# Altium project Vayuvedh_UK_Project.PrjPcb
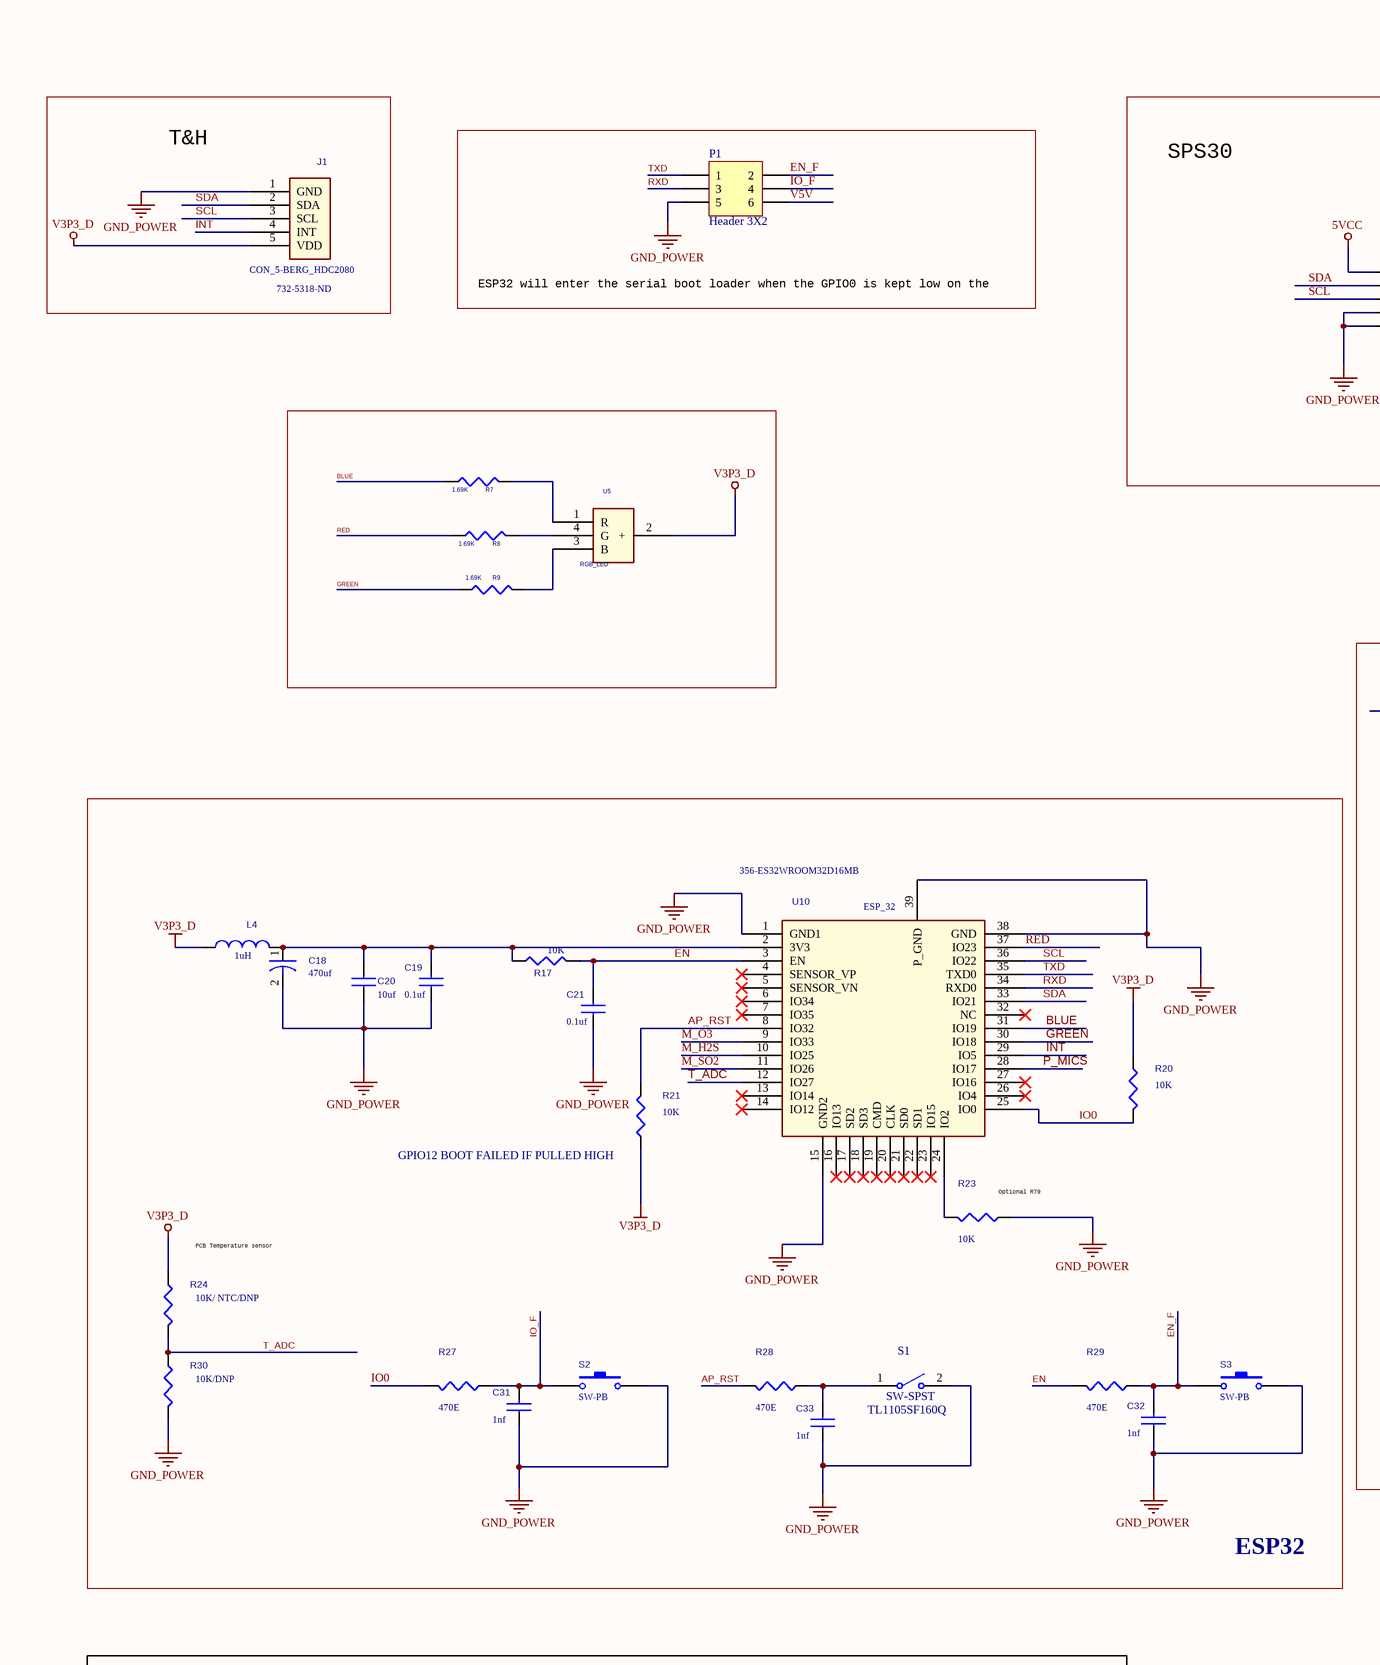
[diagram p0: Vayuvedh U.k.SchDoc, top left]
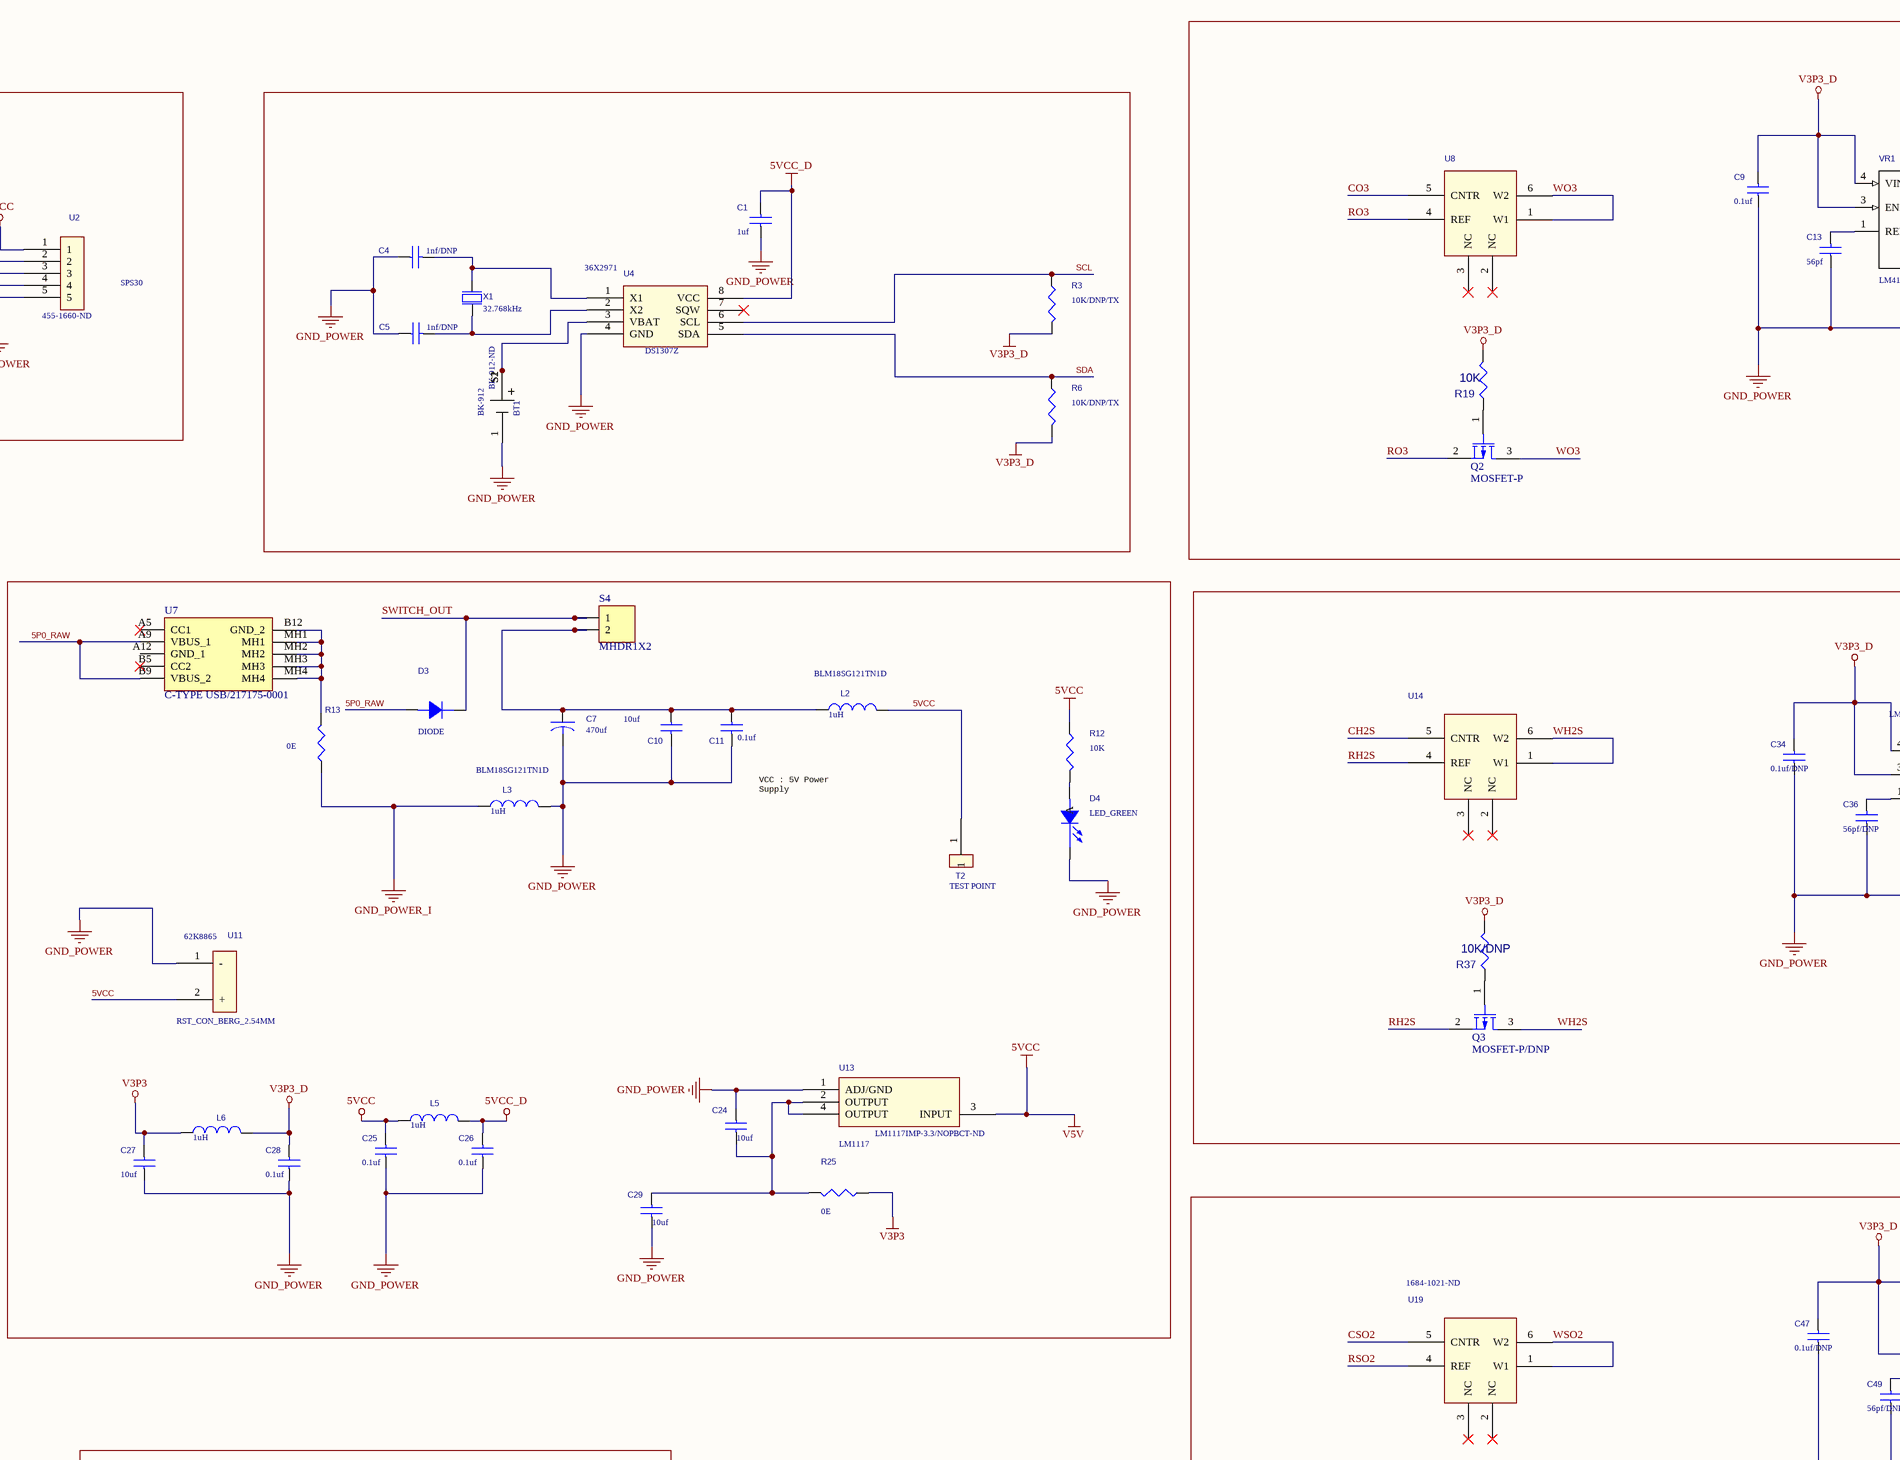
[diagram p1: Vayuvedh U.k.SchDoc, top middle]
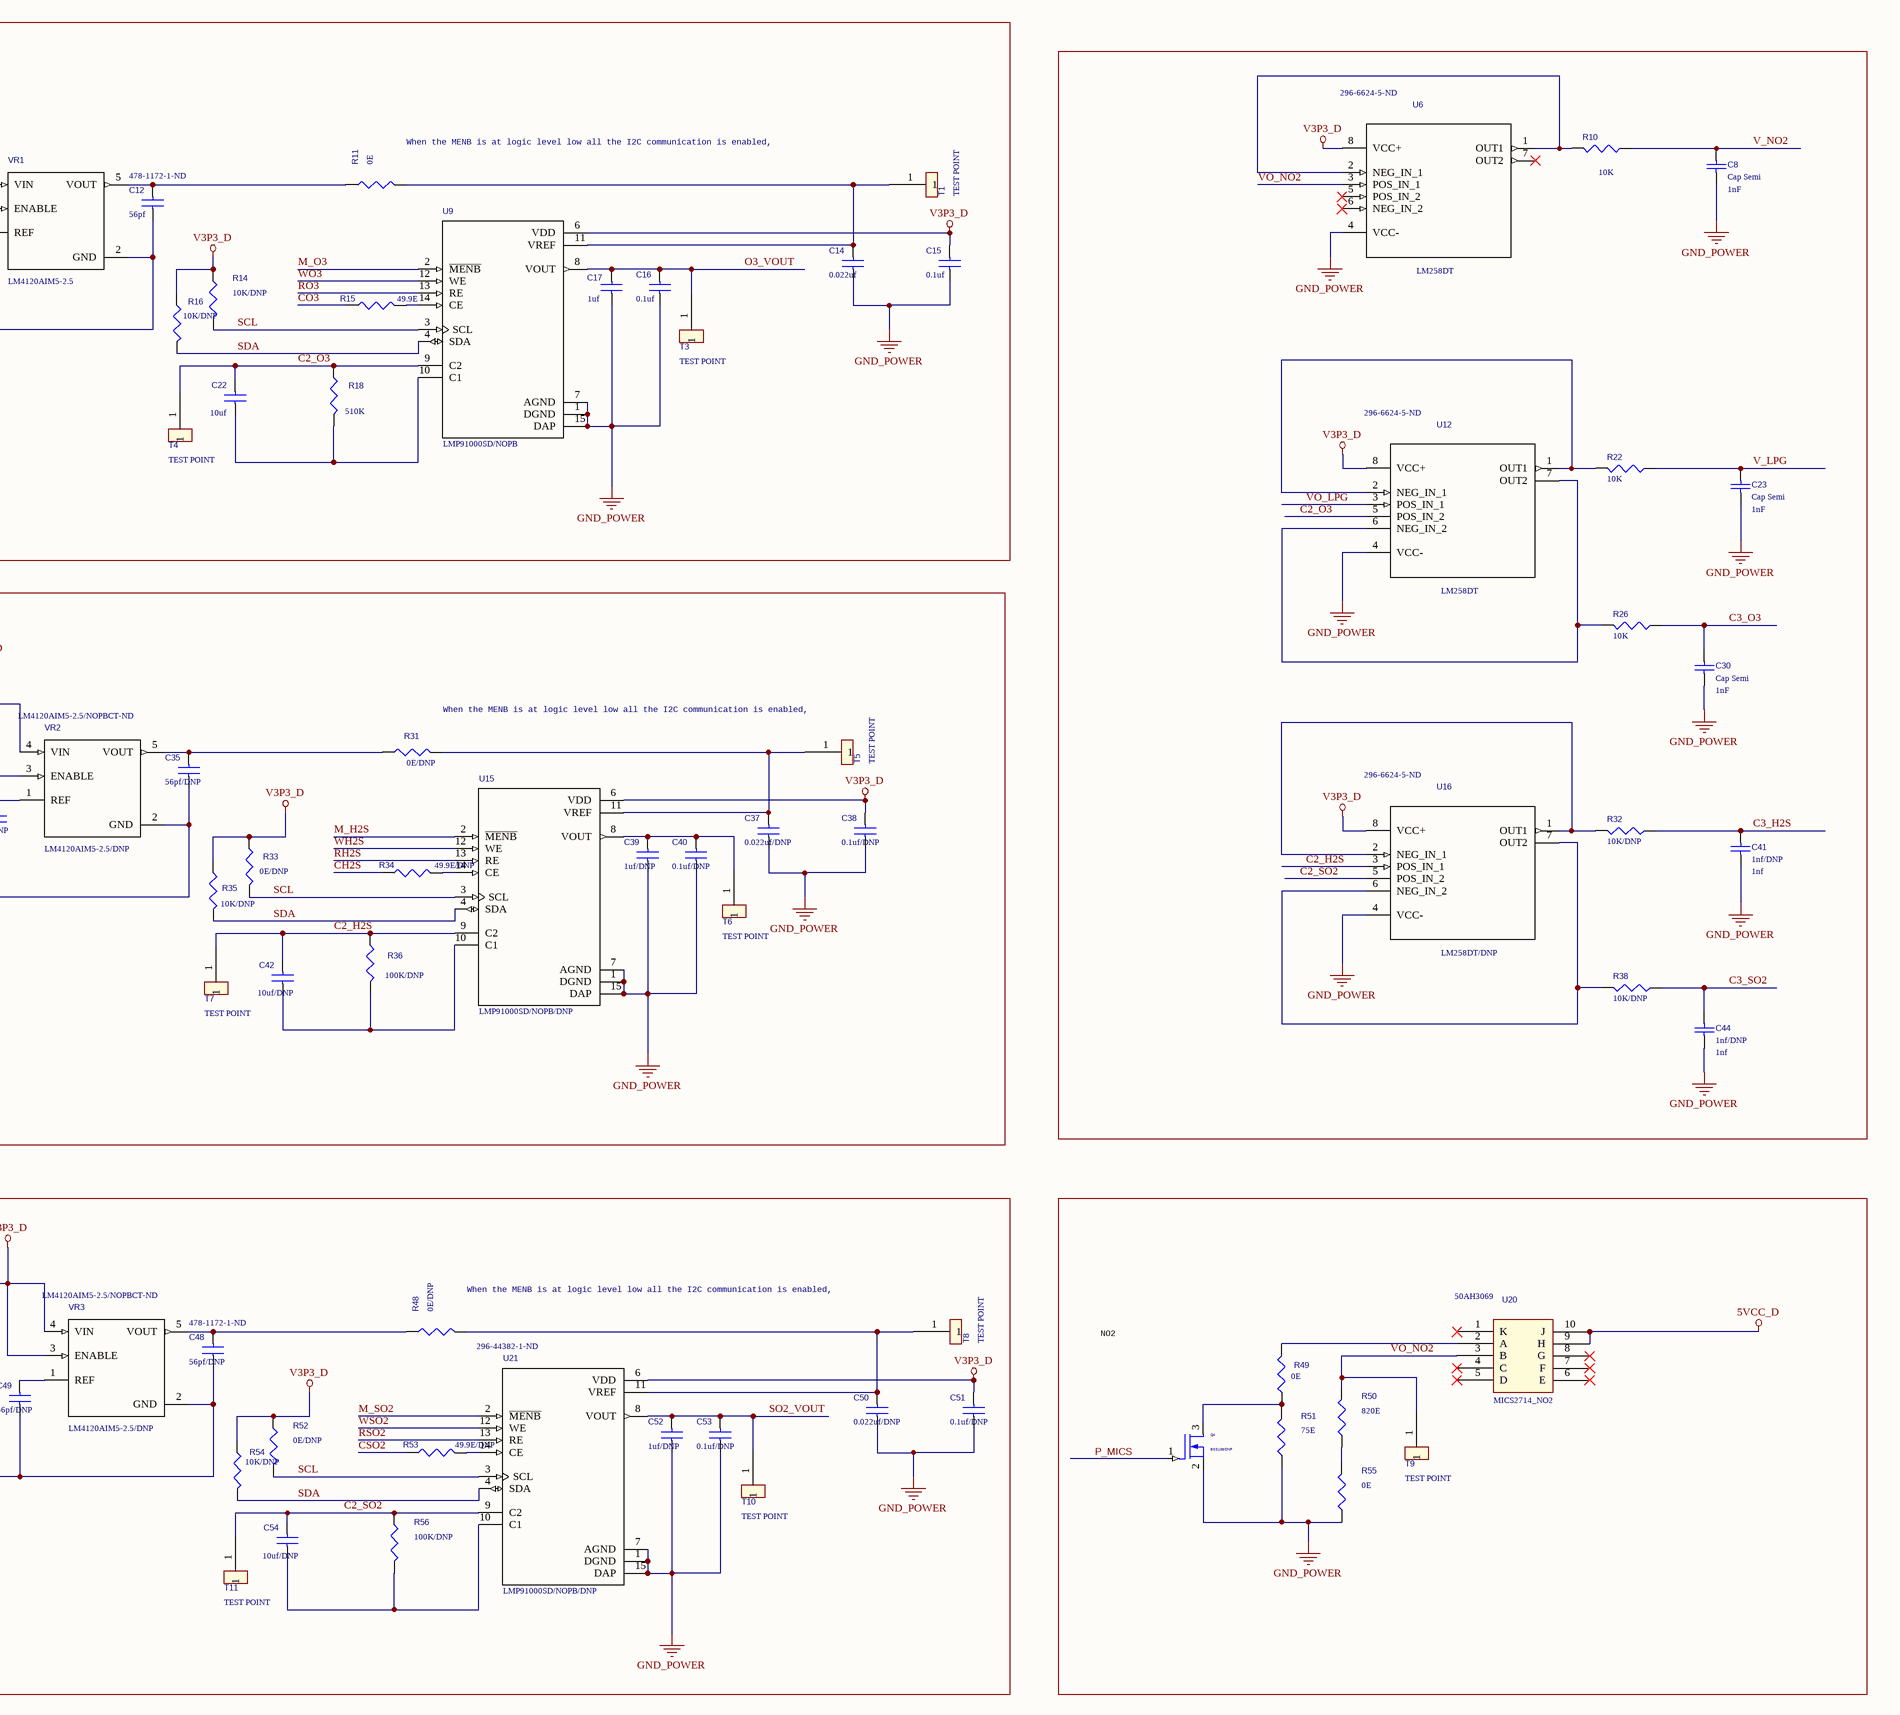
[diagram p2: Vayuvedh U.k.SchDoc, top right]
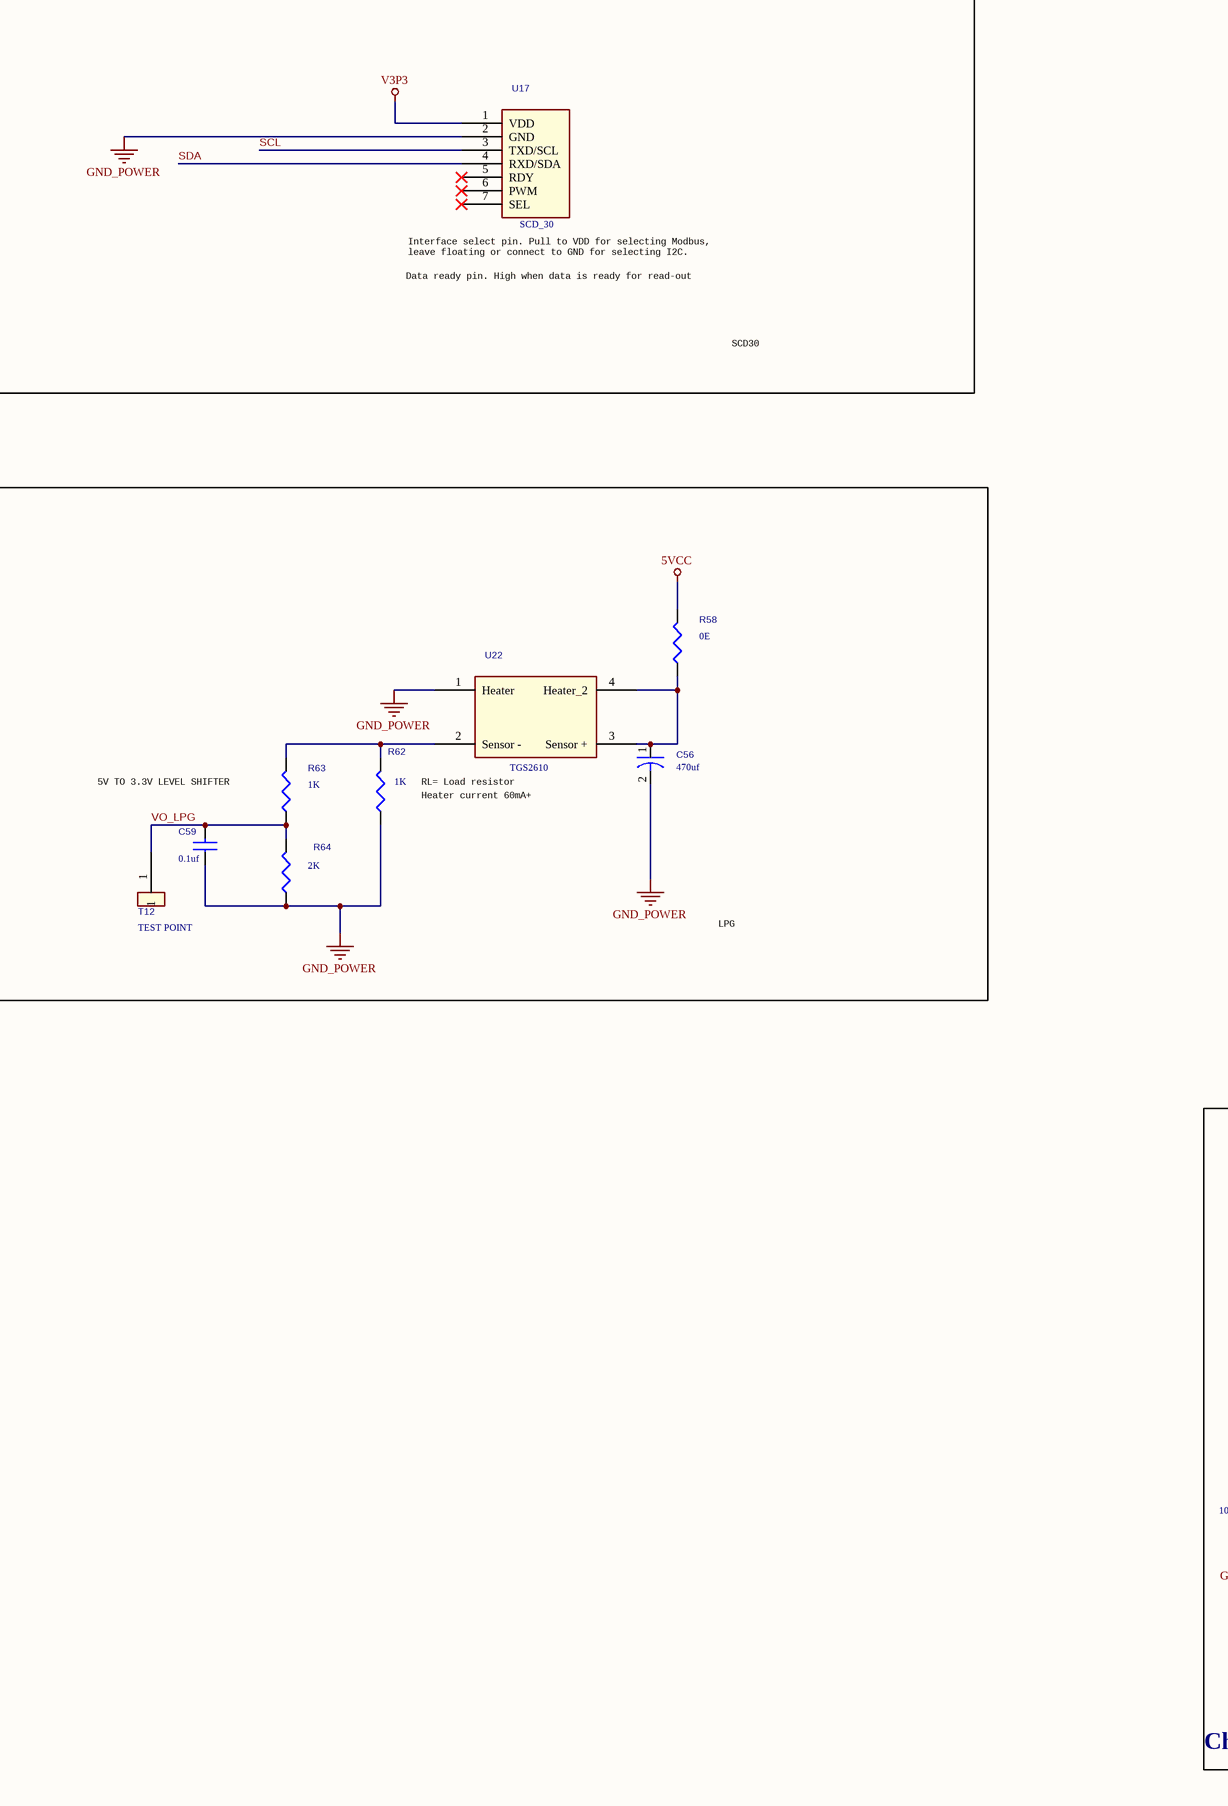
[diagram p3: Vayuvedh U.k.SchDoc, bottom left]
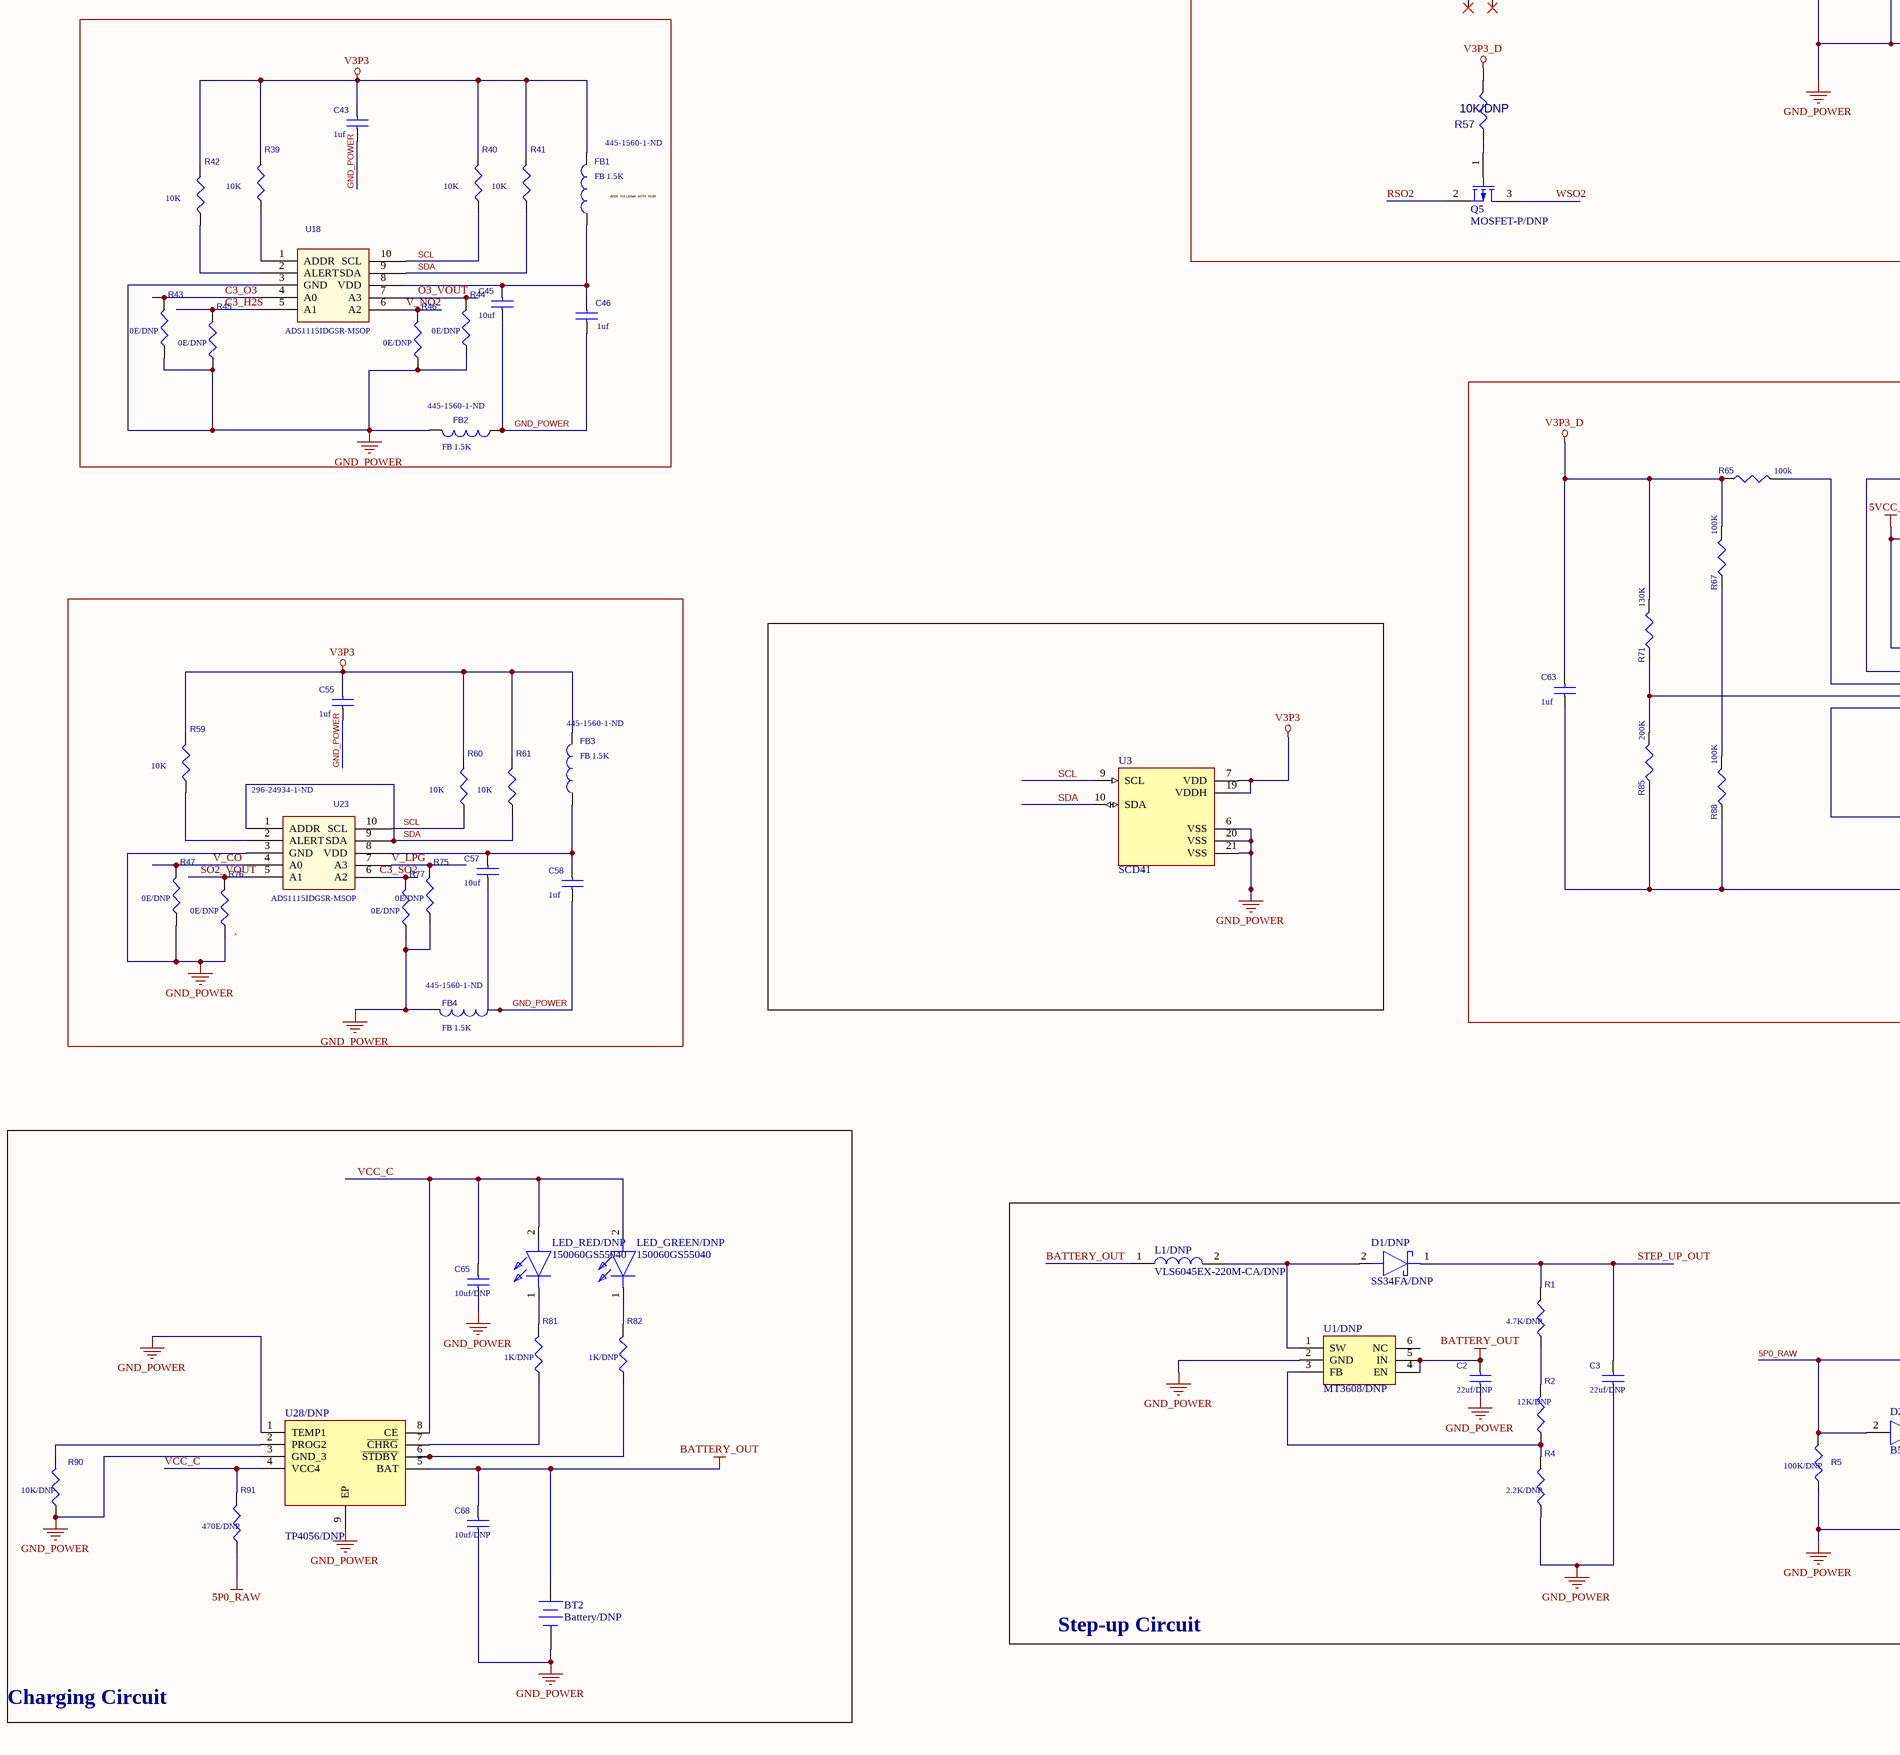
[diagram p4: Vayuvedh U.k.SchDoc, bottom middle]
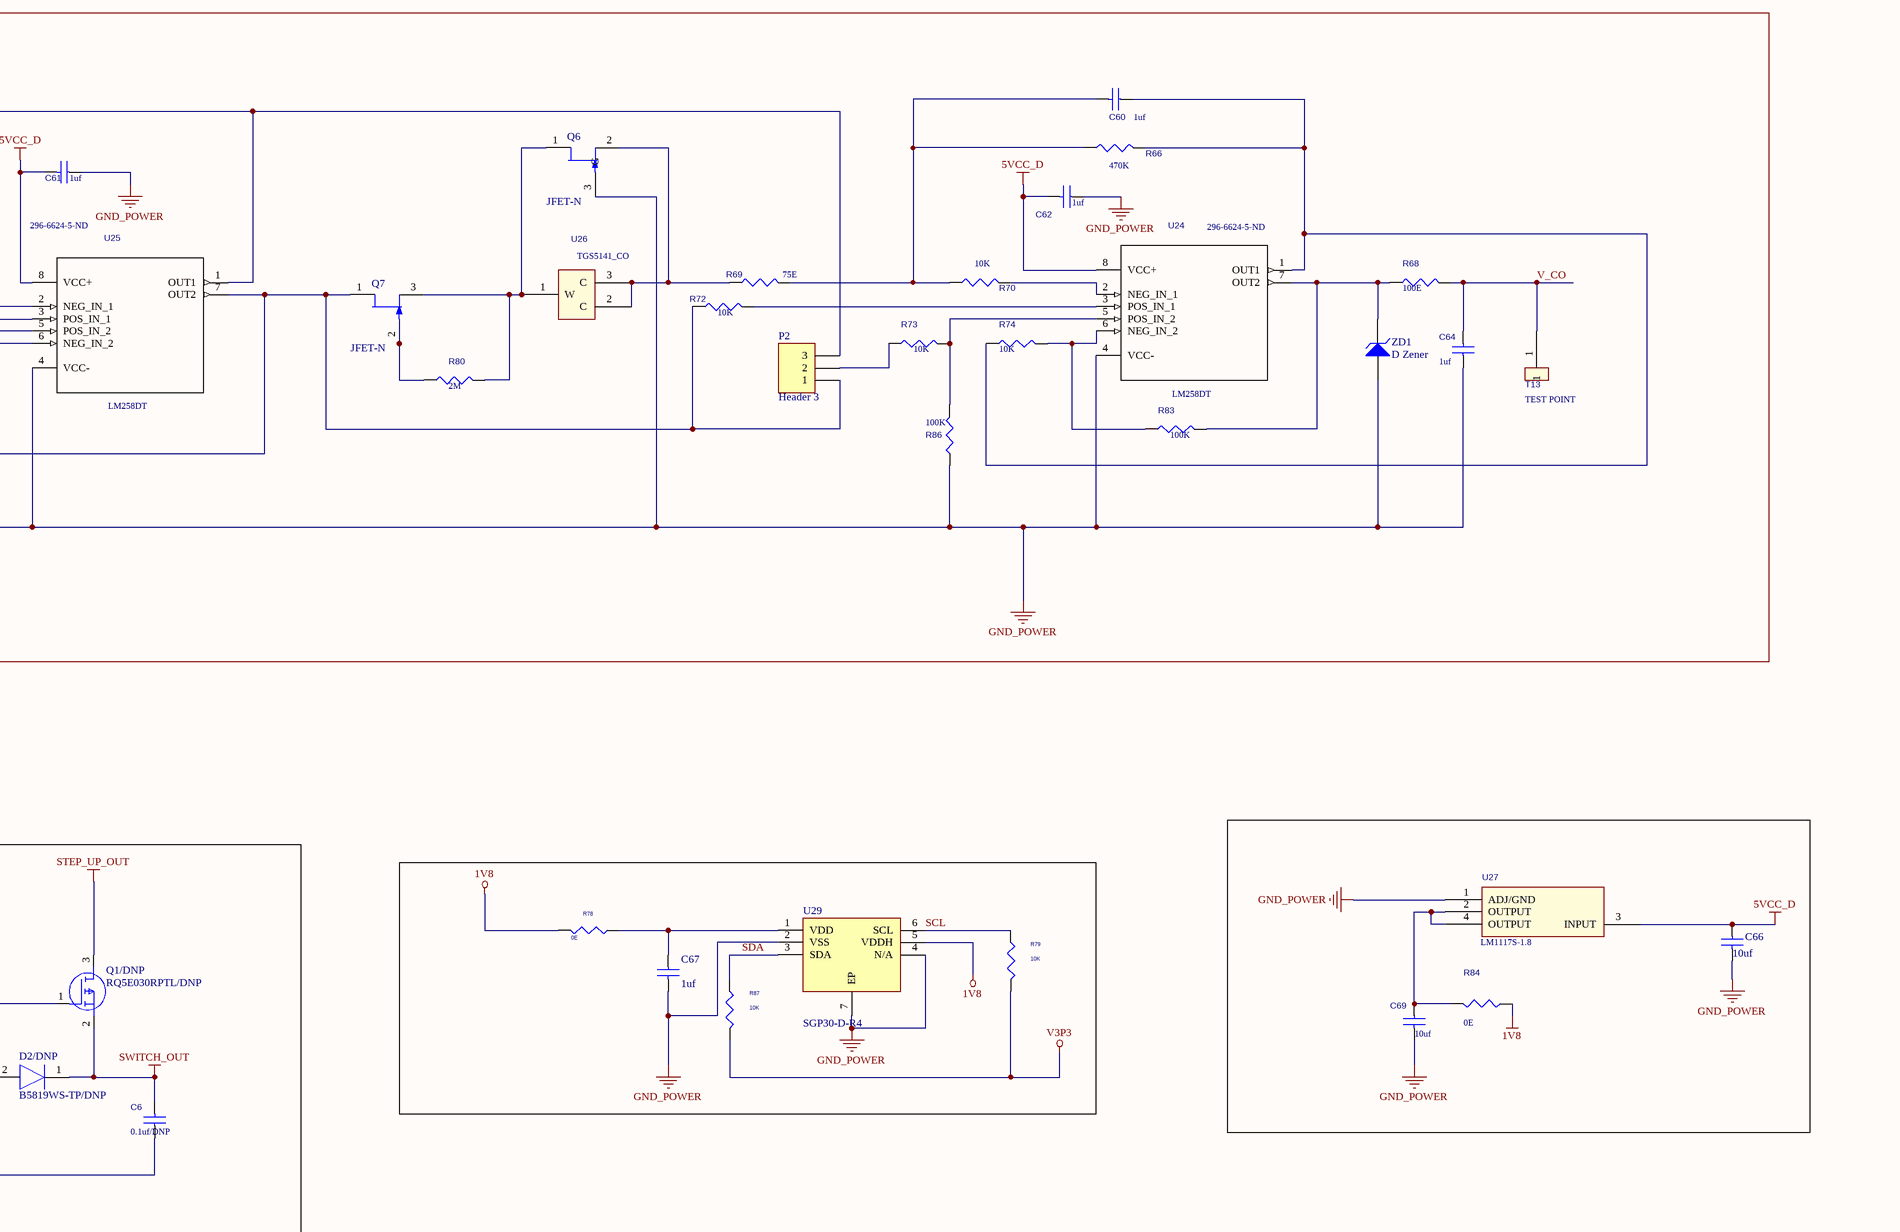
[diagram p5: Vayuvedh U.k.SchDoc, bottom right]
1 sheet, 238 parts. Net scope: global (net labels, ports and power ports of the same name join across sheets).
Board file: Copy of vayuvedh.UK.PcbDoc

## Sheet Vayuvedh U.k.SchDoc
size E

### Parts
BT1  BK-912  Supplier Part Number 1: BK-912-ND  [BT1]
BT2  Battery/DNP  [BAT-2]
C1  1uf  [C0603]
C2  22uf/DNP  [C0603]
C3  22uf/DNP  [C0603]
C4  1nf/DNP  [C0603]
C5  1nf/DNP  [C0603]
C6  0.1uf/DNP  [C0603]
C7  470uf  [C16, C49, C58]
C8  Cap Semi  value 1nF  [C0603]
C9  0.1uf  [C0603]
C10  10uf  [C0603]
C11  0.1uf  [C0603]
C12  56pf  Supplier Part Number 1: 478-1172-1-ND  [C0603]
C13  56pf  [C0603]
C14  0.022uf  [C0603]
C15  0.1uf  [C0603]
C16  0.1uf  [C0603]
C17  1uf  [C0603]
C18  470uf  [C16, C49, C58]
C19  0.1uf  [C0603]
C20  10uf  [C0603]
C21  0.1uf  [C0603]
C22  10uf  [C0603]
C23  Cap Semi  value 1nF  [C0603]
C24  10uf  [C0603]
C25  0.1uf  [C0603]
C26  0.1uf  [C0603]
C27  10uf  [C0603]
C28  0.1uf  [C0603]
C29  10uf  [C0603]
C30  Cap Semi  value 1nF  [C0603]
C31  1nf  [C0603]
C32  1nf  [C0603]
C33  1nf  [C0603]
C34  0.1uf/DNP  [C0603]
C35  56pf/DNP  [C0603]
C36  56pf/DNP  [C0603]
C37  0.022uf/DNP  [C0603]
C38  0.1uf/DNP  [C0603]
C39  1uf/DNP  [C0603]
C40  0.1uf/DNP  [C0603]
C41  1nf/DNP  value 1nf  [C0603]
C42  10uf/DNP  [C0603]
C43  1uf  [C0603]
C44  1nf/DNP  value 1nf  [C0603]
C45  10uf  [C0603]
C46  1uf  [C0603]
C47  0.1uf/DNP  [C0603]
C48  56pf/DNP  Supplier Part Number 1: 478-1172-1-ND  [C0603]
C49  56pf/DNP  [C0603]
C50  0.022uf/DNP  [C0603]
C51  0.1uf/DNP  [C0603]
C52  1uf/DNP  [C0603]
C53  0.1uf/DNP  [C0603]
C54  10uf/DNP  [C0603]
C55  1uf  [C0603]
C56  470uf  [C16, C49, C58]
C57  10uf  [C0603]
C58  1uf  [C0603]
C59  0.1uf  [C0603]
C60  1uf  [C0603]
C61  1uf  [C0603]
C62  1uf  [C0603]
C63  1uf  [C0603]
C64  1uf  [C0603]
C65  10uf/DNP  [C0603]
C66  10uf  [R0603]
C67  1uf  [C0603]
C68  10uf/DNP  [C0603]
C69  10uf  [C0603]
D1/DNP  SS34FA/DNP  [D1]
D2/DNP  B5819WS-TP/DNP  [D1]
D3  DIODE  [D1]
D4  LED_GREEN  [D2              L0603]
FB1  FB 1.5K  Supplier Part Number 1: 445-1560-1-ND  [FB1, FB2, FB3, FB4]
FB2  FB 1.5K  Supplier Part Number 1: 445-1560-1-ND  [FB1, FB2, FB3, FB4]
FB3  FB 1.5K  Supplier Part Number 1: 445-1560-1-ND  [FB1, FB2, FB3, FB4]
FB4  FB 1.5K  Supplier Part Number 1: 445-1560-1-ND  [FB1, FB2, FB3, FB4]
J1  CON_5-BERG_HDC2080  Supplier Part Number 1: 732-5318-ND  [J2]
L1/DNP  VLS6045EX-220M-CA/DNP  [VLS6045]
L2  1uH  Supplier Part Number 1: BLM18SG121TN1D  [L3, L4, L5, L6, L7]
L3  1uH  Supplier Part Number 1: BLM18SG121TN1D  [L3, L4, L5, L6, L7]
L4  1uH  [L3, L4, L5, L6, L7]
L5  1uH  [L3, L4, L5, L6, L7]
L6  1uH  [L3, L4, L5, L6, L7]
LED_GREEN/DNP  150060GS55040  [LEDC1608X50N]
LED_RED/DNP  150060GS55040  [LEDC1608X50N]
P1  Header 3X2  [P5 - new]
P2  Header 3  [P6]
Q1/DNP  RQ5E030RPTL/DNP  [SOT95P280X100-3N]
Q2  MOSFET-P  [Q3-Q5,Q6]
Q3  MOSFET-P/DNP  [Q3-Q5,Q6]
Q4  BSS138/DNP  [Q3-Q5,Q6]
Q5  MOSFET-P/DNP  [Q3-Q5,Q6]
Q6  JFET-N  [SOT23F]
Q7  JFET-N  [Q1-Q2]
R1  4.7K/DNP  [R0603]
R2  12K/DNP  [R0603]
R3  10K/DNP/TX  [R0603]
R4  2.2K/DNP  [R0603]
R5  100K/DNP  [R0603]
R6  10K/DNP/TX  [R0603]
R7  1.69K  [R0603]
R8  1.69K  [R0603]
R9  1.69K  [R0603]
R10  10K  [R0603]
R11  0E  [R0603]
R12  10K  [R0603]
R13  0E  [R0603]
R14  10K/DNP  [R0603]
R15  49.9E  [R0603]
R16  10K/DNP  [R0603]
R17  10K  [R0603]
R18  510K  [R0603]
R19  10K  [R0603]
R20  10K  [R0603]
R21  10K  [R0603]
R22  10K  [R0603]
R23  10K  [R0603]
R24  10K/ NTC/DNP  [R0603]
R25  0E  [R0603]
R26  10K  [R0603]
R27  470E  [R0603]
R28  470E  [R0603]
R29  470E  [R0603]
R30  10K/DNP  [R0603]
R31  0E/DNP  [R0603]
R32  10K/DNP  [R0603]
R33  0E/DNP  [R0603]
R34  49.9E/DNP  [R0603]
R35  10K/DNP  [R0603]
R36  100K/DNP  [R0603]
R37  10K/DNP  [R0603]
R38  10K/DNP  [R0603]
R39  10K  [R0603]
R40  10K  [R0603]
R41  10K  [R0603]
R42  10K  [R0603]
R43  0E/DNP  [R0603]
R44  0E/DNP  [R0603]
R45  0E/DNP  [R0603]
R46  0E/DNP  [R0603]
R47  0E/DNP  [R0603]
R48  0E/DNP  [R0603]
R49  0E  [R0603]
R50  820E  [R0603]
R51  75E  [R0603]
R52  0E/DNP  [R0603]
R53  49.9E/DNP  [R0603]
R54  10K/DNP  [R0603]
R55  0E  [R0603]
R56  100K/DNP  [R0603]
R57  10K/DNP  [R0603]
R58  0E  [R0603]
R59  10K  [R0603]
R60  10K  [R0603]
R61  10K  [R0603]
R62  1K  [R0603]
R63  1K  [R0603]
R64  2K  [R0603]
R65  100k  [R0603]
R66  470K  [R0603]
R67  100K  [R0603]
R68  100E  [R0603]
R69  75E  [R0603]
R70  10K  [R0603]
R71  130K  [R0603]
R72  10K  [R0603]
R73  10K  [R0603]
R74  10K  [R0603]
R75  0E/DNP  [R0603]
R76  0E/DNP  [R0603]
R77  0E/DNP  [R0603]
R78  0E  [R0603]
R79  10K  [R0603]
R80  2M  [R0603]
R81  1K/DNP  [R0603]
R82  1K/DNP  [R0603]
R83  100K  [R0603]
R84  0E  [R0603]
R85  200K  [R0603]
R86  100K  [R0603]
R87  10K  [R0603]
R88  100K  [R0603]
R90  10K/DNP  [R0603]
R91  470E/DNP  [R0603]
S1  SW-SPST  Part Number: TL1105SF160Q  [S1]
S2  SW-PB  [S2, S3]
S3  SW-PB  [S2, S3]
S4  MHDR1X2  [MHDR1X2]
T1  TEST POINT  [TP]
T2  TEST POINT  [TP]
T3  TEST POINT  [TP]
T4  TEST POINT  [TP]
T5  TEST POINT  [TP]
T6  TEST POINT  [TP]
T7  TEST POINT  [TP]
T8  TEST POINT  [TP]
T9  TEST POINT  [TP]
T10  TEST POINT  [TP]
T11  TEST POINT  [TP]
T12  TEST POINT  [TP]
T13  TEST POINT  [TP]
U1/DNP  MT3608/DNP  [SOT95P280X145-6N]
U2  SPS30  Supplier Part Number 1: 455-1660-ND  [U17]
U3  SCD41  [SCD4x]
U4  DS1307Z  Supplier Part Number 1: 36X2971  [U18 new]
U5  RGB_LED  [WL-SFCW_1206]
U6  LM258DT  Supplier Part Number 1: 296-6624-5-ND  [U6, U8                    SOIC-8N]
U7  C-TYPE USB/217175-0001  [MOLEX_2171750001]
U8  SPEC_SENS_PTH_SO2  [U3, U7, U11]  (value not drawn)
U9  LMP91000SD/NOPB  [U5, U10, U13]
U10  ESP_32  Supplier Part Number 1: 356-ES32WROOM32D16MB  [U20             ESP 32]
U11  RST_CON_BERG_2.54MM  Supplier Part Number 1: 62K8865  [U23]
U12  LM258DT  Supplier Part Number 1: 296-6624-5-ND  [U6, U8                    SOIC-8N]
U13  LM1117  Supplier Part Number 1: LM1117IMP-3.3/NOPBCT-ND  [U1, U24              SOT-223]
U14  SPEC_SENS_PTH_SO2  [U3, U7, U11]  (value not drawn)
U15  LMP91000SD/NOPB/DNP  [U5, U10, U13]
U16  LM258DT/DNP  Supplier Part Number 1: 296-6624-5-ND  [U6, U8                    SOIC-8N]
U17  SCD_30  [U3]
U18  ADS1115IDGSR-MSOP  [U19, U20]
U19  Supplier Part Number 1: 1684-1021-ND  [U3, U7, U11]  (hidden comment: SPEC_SENS_PTH_SO2)
U20  MICS2714_NO2  Supplier Part Number 1: 50AH3069  [U12]
U21  LMP91000SD/NOPB/DNP  Supplier Part Number 1: 296-44382-1-ND  [U5, U10, U13]
U22  TGS2610  [U4]
U23  ADS1115IDGSR-MSOP  Supplier Part Number 1: 296-24934-1-ND  [U19, U20]
U24  LM258DT  Supplier Part Number 1: 296-6624-5-ND  [U6, U8                    SOIC-8N]
U25  LM258DT  Supplier Part Number 1: 296-6624-5-ND  [U28]
U26  TGS5141_CO  [U16]
U27  LM1117S-1.8  [U1, U24              SOT-223]
U28/DNP  TP4056/DNP  [SOIC127P600X175-9N]
U29  SGP30-D-R4  [SGP30]
VR1  LM4120AIM5-2.5  [VR1, VR2, VR3]
VR2  LM4120AIM5-2.5/DNP  Supplier Part Number 1: LM4120AIM5-2.5/NOPBCT-ND  [VR1, VR2, VR3]
VR3  LM4120AIM5-2.5/DNP  Supplier Part Number 1: LM4120AIM5-2.5/NOPBCT-ND  [VR1, VR2, VR3]
X1  32.768kHz  [XTAL]
ZD1  D Zener  [ZD1]

### Blocks framed on the sheet
T&H: J1
SPS30: U2
ESP32: C18-C21 C31-C33 L4 R17 R20 R21 R23 R24 R27-R30 S1-S3 U10
NO2: Q4 R49-R51 R55 T9 U20
ADDR PULLDOWN WITH 0X48: C43 C45 C46 FB1 FB2 R39-R46 U18
A: C55 C57 C58 FB3 FB4 R47 R59-R61 R75-R77 U23
Charging Circuit: BT2 C65 C68 LED_GREEN/DNP LED_RED/DNP R81 R82 R90 R91 U28/DNP
Step-up Circuit: C2 C3 C6 D1/DNP D2/DNP L1/DNP Q1/DNP R1 R2 R4 R5 U1/DNP

### Nets
1V8: R78.2 R84.1 U29.5(VDDH)
5P0_RAW: D2/DNP.2(A) D3.2(A) Q1/DNP.1(G) R5.1 R91.2 U7.A9(VBUS_1) U7.B9(VBUS_2)
5VCC: C25.2 L2.2 L5.1 P1.6 R12.1 R58.2 T2.1 U2.1 U11.2(+) U13.3(INPUT)  [also labelled V5V]
5VCC_D: C1.2 C26.2 C61.2 C62.2 C66.1 L5.2 U4.8(VCC) U20.9(H) U20.10(J) U24.8(VCC+) U25.8(VCC+) U27.3(INPUT)
BATTERY_OUT: BT2.1(+) C2.2 C68.2 L1/DNP.1 U1/DNP.4(EN) U1/DNP.5(IN) U28/DNP.5(BAT)
GND_POWER: BT1.1(NEG) BT2.2(-) C1.1 C2.1 C3.1 C4.1 C5.1 C6.1 C7.2 C8.1 C9.1 C10.2 C11.2 C12.1 C13.1 C14.1 C15.1 C16.1 C17.1 C18.2 C19.1 C20.1 C21.1 C23.1 C24.1 C25.1 C26.1 C27.1 C28.1 C29.2 C30.1 C31.1 C32.1 C33.1 C34.1 C35.1 C36.1 C37.1 C38.1 C39.1 C40.1 C41.1 C43.1 C44.1 C45.1 C46.1 C47.1 C48.1 C49.1 C50.1 C51.1 C52.1 C53.1 C55.1 C56.2 C57.1 C58.1 C59.1 C61.1 C62.1 C63.1 C64.1 C65.1 C66.2 C67.2 C68.1 C69.2 D4.2(CATHODE) FB2.1 FB2.2 FB4.1 FB4.2 J1.1(GND) L3.2 P1.5 Q4.2(SOURCE) Q6.3(G) R4.2 R5.2 R23.1 R30.2 R43.2 R44.2 R45.2 R46.2 R47.2 R51.1 R55.1 R62.2 R64.1 R75.2 R76.2 R77.2 R85.1 R86.1 R88.1 R90.2 S1.2(NO) S2.2 S3.2 U1/DNP.2(GND) U2.4 U2.5 U3.6(VSS) U3.20(VSS) U3.21(VSS) U4.4(GND) U6.4(VCC-) U9.1(DGND) U9.7(AGND) U9.15(DAP) U10.1(GND1) U10.15(GND2) U10.38(GND) U10.39(P_GND) U11.1(-) U12.4(VCC-) U13.1(ADJ/GND) U15.1(DGND) U15.7(AGND) U15.15(DAP) U16.4(VCC-) U17.2(GND) U18.3(GND) U21.1(DGND) U21.7(AGND) U21.15(DAP) U22.1(Heater) U23.3(GND) U24.4(VCC-) U25.4(VCC-) U27.1(ADJ/GND) U28/DNP.1(TEMP1) U28/DNP.3(GND_3) U28/DNP.9(EP) U29.2(VSS) U29.4(N/A) U29.7(EP) VR1.2(GND) VR2.2(GND) VR3.2(GND) ZD1.1(A)
GND_POWER_I: L3.1 R13.2
STEP_UP_OUT: C3.2 D1/DNP.1(K) Q1/DNP.3(D) R1.1
SWITCH_OUT: C6.2 D2/DNP.1(K) D3.1(K) Q1/DNP.2(S) S4.1
V3P3: C27.2 C43.2 C55.2 FB1.2 FB3.2 L6.1 R25.1 R39.1 R40.1 R41.1 R42.1 R59.1 R60.1 R61.1 R79.2 R87.2 U3.7(VDD) U3.19(VDDH) U17.1(VDD)
V3P3_D: C9.2 C15.2 C28.2 C34.2 C38.2 C47.2 C51.2 C63.2 J1.5(VDD) L4.1 L6.2 R3.2 R6.2 R14.1 R16.1 R19.2 R20.1 R21.1 R24.1 R33.1 R35.1 R37.2 R52.1 R54.1 R57.2 R65.1 R67.2 R71.2 U5.2(+) U6.8(VCC+) U9.6(VDD) U12.8(VCC+) U15.6(VDD) U16.8(VCC+) U21.6(VDD) VR1.3(ENABLE) VR1.4(VIN) VR2.3(ENABLE) VR2.4(VIN) VR3.3(ENABLE) VR3.4(VIN)
AP_RST: R21.2 R28.2 U10.8(IO32)
BLUE: R7.1 U10.31(IO19)
C2_H2S: C42.2 R36.1 T7.1 U15.9(C2) U16.3(POS_IN_1)
C2_O3: C22.2 R18.1 T4.1 U9.9(C2) U12.5(POS_IN_2)
C2_SO2: C54.2 R56.1 T11.1 U16.5(POS_IN_2) U21.9(C2)
C3_H2S: C41.2 R32.1 R45.1 U18.5(A1)
C3_O3: C30.2 R26.1 R43.1 U18.4(A0)
C3_SO2: C44.2 R38.1
CH2S: R34.1 U14.5(CNTR)
CO3: R15.1 U8.5(CNTR)
CSO2: R53.1 U19.5(CNTR)
EN: C21.2 R17.2 R29.2 U10.3(EN)
EN_F: C32.2 P1.2 R29.1 S3.1
GREEN: R9.1 U10.30(IO18)
INT: J1.4(INT) U10.29(IO5)
IO0: R20.2 R27.2 U10.25(IO0)
IO_F: C31.2 P1.4 R27.1 S2.1
M_H2S: U10.10(IO25) U15.2(~{MENB})
M_O3: U9.2(~{MENB}) U10.9(IO33)
M_SO2: U10.11(IO26) U21.2(~{MENB})
O3_VOUT: C16.2 C17.2 R44.1 T3.1 U9.8(VOUT) U18.7(A3)
P_MICS: Q4.1(GATE) U10.28(IO17)
RED: R8.1 U10.37(IO23)
RH2S: Q3.2(S) U14.4(REF) U15.13(RE)
RO3: Q2.2(S) U8.4(REF) U9.13(RE)
RSO2: Q5.2(S) U19.4(REF) U21.13(RE)
RXD: P1.3 U10.34(RXD0)
SCL: J1.3(SCL) R3.1 R14.2 R33.2 R40.2 R52.2 R60.2 R79.1 U2.3 U3.9(SCL) U4.6(SCL) U9.3(SCL) U10.36(IO22) U15.3(SCL) U17.3(TXD/SCL) U18.10(SCL) U21.3(SCL) U23.10(SCL) U29.6(SCL)
SDA: J1.2(SDA) R6.1 R16.2 R35.2 R41.2 R54.2 R61.2 R87.1 U2.2 U3.10(SDA) U4.5(SDA) U9.4(SDA) U10.33(IO21) U15.4(SDA) U17.4(RXD/SDA) U18.9(SDA) U21.4(SDA) U23.1(ADDR) U23.9(SDA) U29.3(SDA)
SO2_VOUT: C52.2 C53.2 R76.1 T10.1 U21.8(VOUT) U23.5(A1)
T_ADC: R24.2 R30.1 U10.12(IO27)
TXD: P1.1 U10.35(TXD0)
V_CO: C64.2 R47.1 R68.2 T13.1 U23.4(A0)
V_LPG: C23.2 R22.1 R75.1 U23.7(A3)
V_NO2: C8.2 R10.1 R46.1 U18.6(A2)
VCC_C: C65.2 LED_GREEN/DNP.2(A) LED_RED/DNP.2(A) R91.1 U28/DNP.4(VCC4) U28/DNP.8(CE)
VO_LPG: C59.2 R63.1 R64.2 T12.1 U12.3(POS_IN_1)
VO_NO2: R50.2 T9.1 U6.3(POS_IN_1) U20.3(B)
WH2S: Q3.3(D) U14.1(W1) U14.6(W2) U15.12(WE)
WO3: Q2.3(D) U8.1(W1) U8.6(W2) U9.12(WE)
WSO2: Q5.3(D) U19.1(W1) U19.6(W2) U21.12(WE)
NetBT1_S1: BT1.S1(POS) BT1.S2(POS) U4.3(VBAT)
NetC4_2: C4.2 U4.1(X1) X1.1(inp)
NetC5_2: C5.2 U4.2(X2) X1.2(out)
NetC7_1: C7.1 C10.1 C11.1 L2.1 S4.2
NetC12_2: C12.2 R11.1 VR1.5(VOUT)
NetC13_2: C13.2 VR1.1(REF)
NetC14_2: C14.2 R11.2 T1.1 U9.11(VREF)
NetC18_1: C18.1 C19.2 C20.2 L4.2 R17.1 U10.2(3V3)
NetC22_1: C22.1 R18.2 U9.10(C1)
NetC24_2: C24.2 C29.1 R25.2 U13.2(OUTPUT) U13.4(OUTPUT)
NetC33_2: C33.2 R28.1 S1.1(COMMON)
NetC35_2: C35.2 R31.1 VR2.5(VOUT)
NetC36_2: C36.2 VR2.1(REF)
NetC37_2: C37.2 R31.2 T5.1 U15.11(VREF)
NetC39_2: C39.2 C40.2 T6.1 U15.8(VOUT)
NetC42_1: C42.1 R36.2 U15.10(C1)
NetC45_2: C45.2 C46.2 FB1.1 U18.8(VDD)
NetC48_2: C48.2 R48.1 VR3.5(VOUT)
NetC49_2: C49.2 VR3.1(REF)
NetC50_2: C50.2 R48.2 T8.1 U21.11(VREF)
NetC54_1: C54.1 R56.2 U21.10(C1)
NetC56_1: C56.1 R58.1 U22.3(Sensor_+) U22.4(Heater_2)
NetC57_2: C57.2 C58.2 FB3.1 U23.8(VDD)
NetC60_1: C60.1 R66.2 R74.1 U24.1(OUT1)
NetC60_2: C60.2 R66.1 R69.2 R70.1
NetC67_1: C67.1 R78.1 U29.1(VDD)
NetC69_1: C69.1 R84.2 U27.2(OUTPUT) U27.4(OUTPUT)
NetD1/DNP_2: D1/DNP.2(A) L1/DNP.2 U1/DNP.1(SW)
NetD4_1: D4.1(A) R12.2
NetLED_GREEN/DNP_1: LED_GREEN/DNP.1(K) R82.1
NetLED_RED/DNP_1: LED_RED/DNP.1(K) R81.1
NetP2_1: P2.1 Q7.1(D) R72.1 U25.6(NEG_IN_2) U25.7(OUT2)
NetP2_2: P2.2 R73.1
NetP2_3: P2.3 U25.1(OUT1) U25.2(NEG_IN_1)
NetQ2_1: Q2.1(G) R19.1
NetQ3_1: Q3.1(G) R37.1
NetQ4_3: Q4.3(DRAIN) R49.1 R51.2
NetQ5_1: Q5.1(G) R57.1
NetQ6_1: Q6.1(D) Q7.3(S) R80.2 U26.1(W)
NetQ6_2: Q6.2(S) R69.1 U26.2(C) U26.3(C)
NetQ7_2: Q7.2(G) R80.1
NetR1_2: R1.2 R2.1
NetR2_2: R2.2 R4.1 U1/DNP.3(FB)
NetR7_2: R7.2 U5.1(R)
NetR8_2: R8.2 U5.4(G)
NetR9_2: R9.2 U5.3(B)
NetR10_2: R10.2 U6.1(OUT1) U6.2(NEG_IN_1)
NetR13_1: R13.1 U7.B12(GND_2) U7.MH1 U7.MH2 U7.MH3 U7.MH4
NetR15_2: R15.2 U9.14(CE)
NetR22_2: R22.2 U12.1(OUT1) U12.2(NEG_IN_1)
NetR23_2: R23.2 U10.24(IO2)
NetR26_2: R26.2 U12.6(NEG_IN_2) U12.7(OUT2)
NetR32_2: R32.2 U16.1(OUT1) U16.2(NEG_IN_1)
NetR34_2: R34.2 U15.14(CE)
NetR38_2: R38.2 U16.6(NEG_IN_2) U16.7(OUT2)
NetR39_2: R39.2 U18.1(ADDR)
NetR42_2: R42.2 U18.2(ALERT)
NetR49_2: R49.2 U20.2(A)
NetR50_1: R50.1 R55.2
NetR53_2: R53.2 U21.14(CE)
NetR59_2: R59.2 U23.2(ALERT)
NetR62_1: R62.1 R63.2 U22.2(Sensor_-)
NetR65_2: R65.2 U25.3(POS_IN_1)
NetR67_1: R67.1 R88.2
NetR68_1: R68.1 R83.2 U24.7(OUT2) ZD1.2(K)
NetR70_2: R70.2 U24.2(NEG_IN_1)
NetR71_1: R71.1 R85.2 U25.5(POS_IN_2)
NetR72_2: R72.2 U24.3(POS_IN_1)
NetR73_2: R73.2 R86.2 U24.5(POS_IN_2)
NetR74_2: R74.2 R83.1 U24.6(NEG_IN_2)
NetR77_1: R77.1 U23.6(A2)
NetR81_2: R81.2 U28/DNP.7(~{CHRG})
NetR82_2: R82.2 U28/DNP.6(~{STDBY})
NetR90_1: R90.1 U28/DNP.2(PROG2)

Not connected (* = marked no-connect by the designer): U1/DNP 6(NC); U4 7(SQW)*; U6 5(POS_IN_2)* 6(NEG_IN_2)* 7(OUT2)*; U7 A5(CC1)* A12(GND_1) B5(CC2)*; U8 2(NC)* 3(NC)*; U10 4(SENSOR_VP)* 5(SENSOR_VN)* 6(IO34)* 7(IO35)* 13(IO14)* 14(IO12)* 16(IO13)* 17(SD2)* 18(SD3)* 19(CMD)* 20(CLK)* 21(SD0)* 22(SD1)* 23(IO15)* 26(IO4)* 27(IO16)* 32(NC)*; U14 2(NC)* 3(NC)*; U17 5(RDY)* 6(PWM)* 7(SEL)*; U19 2(NC)* 3(NC)*; U20 1(K)* 4(C)* 5(D)* 6(E)* 7(F)* 8(G)*

### Notes on the sheet
- (near R11) When the MENB is at logic level low all the I2C communication is enabled,
- ESP32 will enter the serial boot loader when the GPIO0 is kept low on the reset.
  Otherwise, it will run the program in flash.
- (near R31) When the MENB is at logic level low all the I2C communication is enabled,
- VCC : 5V Power Supply
  D-  : USB D- Signal
  D+ : USB D+ Signal
  ID  : USB Identifier Signal for OTG Devices
  GND : Power Ground
- (near R21) GPIO12 BOOT FAILED IF PULLED HIGH
- (near R24) PCB Temperature sensor
- (near R23) Optional R79
- (near R48) When the MENB is at logic level low all the I2C communication is enabled,
- Data ready pin. High when data is ready for read-out
- (near U17) Interface select pin. Pull to VDD for selecting Modbus,
  leave floating or connect to GND for selecting I2C.
- SCD30
- 5V TO 3.3V LEVEL SHIFTER
- RL= Load resistor
- Heater current 60mA+
- LPG
- Labels drawn without touching a wire or pin: C3_SO2
- Title
- Size:
- Date:
- File:
- E
- Number:
- Time:
- Revision:
- Sheet
- of

### Library data of the parts
BT1 = BK-912: BATTERY RETAINER COIN 20MM SMD; MF: MPD; Price: None; Package: None; MP: BK-912; Availability: Unavailable; SnapEDA_Link: https://www.snapeda.com/parts/BK-912/Memory%20Protection%20Devices/view-part/4219672/?ref=snap; Value: *; Supplier 1: Digi-Key
BT2 = Battery: Multicell Battery; Published: 24-Mar-1999; LatestRevisionDate: 17-Jul-2002; LatestRevisionNote: Re-released for DXP Platform.; PackageReference: BAT-2; Publisher: Altium Limited; PackageDescription: Battery; 2 Leads
C1-C3 C6 C43 C45 C46 C55 C57-C65 C68 = CAP_C_0.1µF/16V: CAP CER SMD 0.1µF/16V; Manufacturer: Murata Electronics North America; Manufacturer Part Number: GRM155R61H104KE19D; Capacitance: 1nF; Tolerance: ±10%; Voltage - Rated: 16V; Temperature Coefficient: X5R; Supplier 1: Digi-Key; Supplier Part Number 1: 490-11917-1-ND; RoHS: RoHS Compliant; Category: Capacitors; Stock 1: 958509; Pricing 1: 1=0.1, 10=0.062, 25=0.0456, 50=0.034, 100=0.0278, 250=0.02328, 500=0.01988, 1000=0.01562, 5000=0.01307 (USD); Packaging: Cut Tape (CT); Part Status: Active; Operating Temperature: -55°C ~ 85°C; Features: -; Ratings: -; Applications: General Purpose; Mounting Type: Surface Mount, MLCC; Size / Dimension: 0.039" L x 0.020" W (1.00mm x 0.50mm); Height - Seated (Max): -; Thickness (Max): 0.022" (0.55mm); Lead Spacing: -; Lead Style: -; ComponentLink1URL: http://www.murata.com/~/media/webrenewal/support/library/catalog/products/capacitor/mlcc/c02e.ashx; ComponentLink1Description: http://www.murata.com/~/media/webrenewal/support/library/catalog/products/capacitor/mlcc/c02e.ashx
C4 C5 C10 C11 = CAP NP: CAP CER 22UF 10V X5R 0603; Part Number: GRM188R61A226ME15D
C7 C18 C56 = CAP: CAP ALUM 470UF 20% 50V RADIAL; Part Number: 871-B41896E6477M000
C8 C23 C30 C41 C44 = Cap Semi: Capacitor (Semiconductor SIM Model); Published: 8-Jun-2000; LatestRevisionDate: 29-May-2009; LatestRevisionNote: IPC-7351 Footprint Added.; PackageReference: C1206; Publisher: Altium Limited; PackageDescription: Chip Capacitor
C9 C14-C17 C21 C25-C28 C34 C37-C40 C47 C50-C53 = CAP_C_0.1µF/16V: CAP CER SMD 0.1µF/16V; Manufacturer: Murata Electronics North America; Manufacturer Part Number: GRM155R61H104KE19D; Capacitance: 0.1µF; Tolerance: ±10%; Voltage - Rated: 16V; Temperature Coefficient: X5R; RoHS: RoHS Compliant; Category: Capacitors; Stock 1: 958509; Pricing 1: 1=0.1, 10=0.062, 25=0.0456, 50=0.034, 100=0.0278, 250=0.02328, 500=0.01988, 1000=0.01562, 5000=0.01307 (USD); Packaging: Cut Tape (CT); Part Status: Active; Operating Temperature: -55°C ~ 85°C; Features: -; Ratings: -; Applications: General Purpose; Mounting Type: Surface Mount, MLCC; Package / Case: 0402 (1005 Metric); Size / Dimension: 0.039" L x 0.020" W (1.00mm x 0.50mm); Height - Seated (Max): -; Thickness (Max): 0.022" (0.55mm); Lead Spacing: -; Lead Style: -; ComponentLink1URL: http://www.murata.com/~/media/webrenewal/support/library/catalog/products/capacitor/mlcc/c02e.ashx; ComponentLink1Description: http://www.murata.com/~/media/webrenewal/support/library/catalog/products/capacitor/mlcc/c02e.ashx; Supplier 1: Digi-Key
  C9 C34 C47: Supplier Part Number 1: 311-1088-1-ND
  C14-C17 C21 C25-C28 C37-C40 C50-C53: Supplier Part Number 1: 490-11917-1-ND
C12 C35 C48 = CAP_C_0.1µF/16V: CAP CER SMD 56pF; Manufacturer: Murata Electronics North America; Manufacturer Part Number: 06035A560JAT2A; Capacitance: 0.1µF; Tolerance: ±10%; Voltage - Rated: 16V; Temperature Coefficient: X5R; RoHS: RoHS Compliant; Category: Capacitors; Stock 1: 958509; Pricing 1: 1=0.1, 10=0.062, 25=0.0456, 50=0.034, 100=0.0278, 250=0.02328, 500=0.01988, 1000=0.01562, 5000=0.01307 (USD); Packaging: Cut Tape (CT); Part Status: Active; Operating Temperature: -55°C ~ 85°C; Features: -; Ratings: -; Applications: General Purpose; Mounting Type: Surface Mount, MLCC; Package / Case: 0402 (1005 Metric); Size / Dimension: 0.039" L x 0.020" W (1.00mm x 0.50mm); Height - Seated (Max): -; Thickness (Max): 0.022" (0.55mm); Lead Spacing: -; Lead Style: -; ComponentLink1URL: http://www.murata.com/~/media/webrenewal/support/library/catalog/products/capacitor/mlcc/c02e.ashx; ComponentLink1Description: http://www.murata.com/~/media/webrenewal/support/library/catalog/products/capacitor/mlcc/c02e.ashx; Supplier 1: Digi-Key
  C35: Supplier Part Number 1: 478-1172-1-ND
C13 C36 C49 = CAP_C_0.1µF/16V: CAP CER SMD 56pF; Manufacturer: Murata Electronics North America; Manufacturer Part Number: GRM155R61H104KE19D; Capacitance: 0.1µF; Tolerance: ±10%; Voltage - Rated: 16V; Temperature Coefficient: X5R; Supplier 1: Digi-Key; Supplier Part Number 1: 490-11917-1-ND; RoHS: RoHS Compliant; Category: Capacitors; Stock 1: 958509; Pricing 1: 1=0.1, 10=0.062, 25=0.0456, 50=0.034, 100=0.0278, 250=0.02328, 500=0.01988, 1000=0.01562, 5000=0.01307 (USD); Packaging: Cut Tape (CT); Part Status: Active; Operating Temperature: -55°C ~ 85°C; Features: -; Ratings: -; Applications: General Purpose; Mounting Type: Surface Mount, MLCC; Package / Case: 0402 (1005 Metric); Size / Dimension: 0.039" L x 0.020" W (1.00mm x 0.50mm); Height - Seated (Max): -; Thickness (Max): 0.022" (0.55mm); Lead Spacing: -; Lead Style: -; ComponentLink1URL: http://www.murata.com/~/media/webrenewal/support/library/catalog/products/capacitor/mlcc/c02e.ashx; ComponentLink1Description: http://www.murata.com/~/media/webrenewal/support/library/catalog/products/capacitor/mlcc/c02e.ashx
C19 = CAP_C_0.1µF/16V: CAP CER SMD 0.1µF/16V; Manufacturer: Murata Electronics North America; Manufacturer Part Number: CC0603KRX7R7BB104; Capacitance: 0.1µF; Tolerance: ±10%; Voltage - Rated: 16V; Temperature Coefficient: X5R; RoHS: RoHS Compliant; Category: Capacitors; Stock 1: 958509; Pricing 1: 1=0.1, 10=0.062, 25=0.0456, 50=0.034, 100=0.0278, 250=0.02328, 500=0.01988, 1000=0.01562, 5000=0.01307 (USD); Packaging: Cut Tape (CT); Part Status: Active; Operating Temperature: -55°C ~ 85°C; Features: -; Ratings: -; Applications: General Purpose; Mounting Type: Surface Mount, MLCC; Package / Case: 0603; Size / Dimension: 0.039" L x 0.020" W (1.00mm x 0.50mm); Height - Seated (Max): -; Thickness (Max): 0.022" (0.55mm); Lead Spacing: -; Lead Style: -; ComponentLink1URL: http://www.murata.com/~/media/webrenewal/support/library/catalog/products/capacitor/mlcc/c02e.ashx; ComponentLink1Description: http://www.murata.com/~/media/webrenewal/support/library/catalog/products/capacitor/mlcc/c02e.ashx; Supplier 1: Digi-Key; Supplier Part Number 1: 311-1088-1-ND
C20 = CAP_C_10µF/10V: CAP CER SMD 10µF/10V; Manufacturer: Yageo; Manufacturer Part Number: CC0805ZKY5V6BB106; Capacitance: 10µF; Tolerance: -20%, +80%; Voltage - Rated: 10V; Temperature Coefficient: Y5V (F); Supplier 1: Digi-Key; Supplier Part Number 1: 311-1355-1-ND; RoHS: RoHS Compliant; Category: Capacitors; Stock 1: 595702; Pricing 1: 1=0.18, 10=0.131, 25=0.0956, 50=0.0742, 100=0.0615, 250=0.05088, 500=0.04312, 1000=0.03569 (USD); Packaging: Cut Tape (CT); Part Status: Active; Operating Temperature: -30°C ~ 85°C; Features: -; Ratings: -; Applications: General Purpose; Failure Rate: -; Mounting Type: Surface Mount, MLCC; Package / Case: 0805 (2012 Metric); Size / Dimension: 0.079" L x 0.049" W (2.00mm x 1.25mm); Height - Seated (Max): -; Thickness (Max): 0.049" (1.25mm); Lead Spacing: -; Lead Style: -; ComponentLink1URL: http://www.yageo.com/documents/recent/UPY-GPHC_Y5V_6.3V-to-50V_8.pdf; ComponentLink1Description: http://www.yageo.com/documents/recent/UPY-GPHC_Y5V_6.3V-to-50V_8.pdf
C22 C42 C54 = CAP_C_0.1µF/16V: CAP CER SMD 10uF; Capacitance: 0.1µF; Tolerance: ±10%; Temperature Coefficient: X5R; RoHS: RoHS Compliant; Category: Capacitors; Pricing 1: 1=0.1, 10=0.062, 25=0.0456, 50=0.034, 100=0.0278, 250=0.02328, 500=0.01988, 1000=0.01562, 5000=0.01307 (USD); Packaging: Cut Tape (CT); Part Status: Active; Operating Temperature: -55°C ~ 85°C; Features: -; Ratings: -; Applications: General Purpose; Mounting Type: Surface Mount, MLCC; Package / Case: 0603; Height - Seated (Max): -; Thickness (Max): 0.022" (0.55mm); Lead Spacing: -; Lead Style: -; ComponentLink1URL: http://www.murata.com/~/media/webrenewal/support/library/catalog/products/capacitor/mlcc/c02e.ashx; ComponentLink1Description: http://www.murata.com/~/media/webrenewal/support/library/catalog/products/capacitor/mlcc/c02e.ashx
C24 C29 C66 C69 = CAP_C_10µF/35V: CAP CER SMD 10µF/35V; Manufacturer: Taiyo Yuden; Manufacturer Part Number: GMK316AB7106KL-TR; Capacitance: 10µF; Tolerance: ±10%; Voltage - Rated: 35V; Temperature Coefficient: X7R; Supplier 1: Digi-Key; Supplier Part Number 1: 587-3007-1-ND; RoHS: RoHS Compliant; Category: Capacitors; Stock 1: 533940; Pricing 1: 1=0.51, 10=0.362, 25=0.3092, 50=0.274, 100=0.2387, 250=0.20328, 500=0.17678, 1000=0.15026 (USD); Packaging: Cut Tape (CT); Part Status: Active; Operating Temperature: -55°C ~ 125°C; Features: -; Ratings: -; Applications: General Purpose; Mounting Type: Surface Mount, MLCC; Package / Case: 1206 (3216 Metric); Size / Dimension: 0.126" L x 0.063" W (3.20mm x 1.60mm); Height - Seated (Max): -; Thickness (Max): 0.071" (1.80mm); Lead Spacing: -; Lead Style: -; ComponentLink1URL: http://www.yuden.co.jp/productdata/catalog/en/mlcc06_e.pdf; ComponentLink1Description: http://www.yuden.co.jp/productdata/catalog/en/mlcc06_e.pdf
C31-C33 = CAP_C_0.1µF/16V: CAP CER SMD 0.1µF/16V; Manufacturer: Murata Electronics North America; Manufacturer Part Number: GRM155R61H104KE19D; Tolerance: ±10%; Voltage - Rated: 16V; Temperature Coefficient: X5R; Supplier 1: Digi-Key; Supplier Part Number 1: 490-11917-1-ND; RoHS: RoHS Compliant; Category: Capacitors; Stock 1: 958509; Pricing 1: 1=0.1, 10=0.062, 25=0.0456, 50=0.034, 100=0.0278, 250=0.02328, 500=0.01988, 1000=0.01562, 5000=0.01307 (USD); Packaging: Cut Tape (CT); Part Status: Active; Capacitance: 1nF; Operating Temperature: -55°C ~ 85°C; Features: -; Ratings: -; Applications: General Purpose; Mounting Type: Surface Mount, MLCC; Package / Case: 0402 (1005 Metric); Size / Dimension: 0.039" L x 0.020" W (1.00mm x 0.50mm); Height - Seated (Max): -; Thickness (Max): 0.022" (0.55mm); Lead Spacing: -; Lead Style: -; ComponentLink1URL: http://www.murata.com/~/media/webrenewal/support/library/catalog/products/capacitor/mlcc/c02e.ashx; ComponentLink1Description: http://www.murata.com/~/media/webrenewal/support/library/catalog/products/capacitor/mlcc/c02e.ashx
C67 = CAP_C_0.1µF/50V: CAP CER SMD 0.1µF/50V; Manufacturer: Yageo; Manufacturer Part Number: CC0805ZRY5V9BB104; Capacitance: 1µF; Tolerance: -20%, +80%; Voltage - Rated: 50V; Temperature Coefficient: Y5V (F); Supplier 1: Digi-Key; Supplier Part Number 1: 311-1361-1-ND; RoHS: RoHS Compliant; Category: Capacitors; Stock 1: 934185; Pricing 1: 1=0.1, 10=0.036, 25=0.0264, 50=0.0198, 100=0.0162, 250=0.01352, 500=0.01156, 1000=0.00908 (USD); Packaging: Cut Tape (CT); Part Status: Active; Operating Temperature: -30°C ~ 85°C; Features: -; Ratings: -; Applications: General Purpose; Failure Rate: -; Mounting Type: Surface Mount, MLCC; Package / Case: 0805 (2012 Metric); Size / Dimension: 0.079" L x 0.049" W (2.00mm x 1.25mm); Height - Seated (Max): -; Thickness (Max): 0.024" (0.60mm); Lead Spacing: -; Lead Style: -; ComponentLink1URL: http://www.yageo.com/documents/recent/UPY-GPHC_Y5V_6.3V-to-50V_8.pdf; ComponentLink1Description: http://www.yageo.com/documents/recent/UPY-GPHC_Y5V_6.3V-to-50V_8.pdf
D1/DNP = SS34FA: Schottky Diode; Manufacturer_Name: ON Semiconductor; Datasheet Link: http://www.onsemi.com/pub/Collateral/SS36FA-D.pdf; Height: 1.43mm; Manufacturer_Part_Number: SS34FA; Mouser Part Number: 512-SS34FA; Mouser Price/Stock: https://www.mouser.co.uk/ProductDetail/ON-Semiconductor-Fairchild/SS34FA?qs=R26iFe%2FkX%2FK1QUwZdCmBBw%3D%3D; Arrow Part Number: SS34FA; Arrow Price/Stock: https://www.arrow.com/en/products/ss34fa/on-semiconductor?region=nac
D2/DNP = B5819WS-TP: Diode; Manufacturer_Name: Micro Commercial Components (MCC); Datasheet Link: https://www.arrow.com/en/products/b5819ws-tp/micro-commercial-components; Height: 1.15mm; Manufacturer_Part_Number: B5819WS-TP; Mouser Part Number: 833-B5819WS-TP; Mouser Price/Stock: https://www.mouser.co.uk/ProductDetail/Micro-Commercial-Components-MCC/B5819WS-TP?qs=SdqRYZZ9IxBOLbXcW6zYBA%3D%3D; Arrow Part Number: B5819WS-TP; Arrow Price/Stock: https://www.arrow.com/en/products/b5819ws-tp/micro-commercial-components?region=asia
D3 = DIODE: DIODE GEN PURP 1KV 1A DO214AC; part number: 641-1018-2-ND
D4 = LED: LED GREEN CLEAR THIN 0603 SMD; Manufacturer Part Number: 160-1443-2-ND; Type: Diode; Distributor Part Number: 160-1443-1-ND; Package: 0603; Part Number: 160-1443-2-ND; Supplier 1: Future Electronics; Supplier Part Number 1: LTL-1CHG-BAG
FB1-FB4 = INDUCTOR_Dup1: Ferrite Beads 1.5K OHM 25%; Part Number: MMZ2012Y152B; Distributor Part Number: MMZ2012Y152B; Manufacturer Part Number: MMZ2012Y152B; Type: Ferrite; Package: 0603; Supplier 1: Digi-Key
J1 = 5_PIN_CON_0: CONN HEADER VERT 5POS 2.54MM; Part Number: 61300511121; Supplier 1: Digi-Key
L1/DNP = VLS6045EX-220M-CA: Inductor; Manufacturer_Name: TDK; Datasheet Link: https://product.tdk.com/system/files/dam/doc/product/inductor/inductor/smd/catalog/inductor_automotive_power_vls6045ex-ca_en.pdf; Manufacturer_Part_Number: VLS6045EX-220M-CA; Mouser Part Number: 810-VLS6045EX220MCA; Mouser Price/Stock: https://www.mouser.com/Search/Refine.aspx?Keyword=810-VLS6045EX220MCA; Arrow Part Number: VLS6045EX-220M-CA; Arrow Price/Stock: https://www.arrow.com/en/products/vls6045ex-220m-ca/tdk
L2-L6 = INDUCTOR: FERRITE BEAD 120 OHM 0603 1LN; Part Number: 490-3996-1-ND; Supplier 1: Arrow
  L4-L6: Supplier Part Number 1: BLM18SG121TN1D
LED_GREEN/DNP LED_RED/DNP = 150060GS55040: LED; Manufacturer_Name: Wurth Elektronik; Datasheet Link: https://katalog.we-online.de/led/datasheet/150060GS55040.pdf; Height: 0.5mm; Manufacturer_Part_Number: 150060GS55040; Mouser Part Number: 710-150060GS55040; Mouser Price/Stock: https://www.mouser.co.uk/ProductDetail/Wurth-Elektronik/150060GS55040?qs=fAHHVMwC%252Bbhr5Aln2oA6Nw%3D%3D
P1 = Header 3X2: Header, 3-Pin, Dual row; LatestRevisionDate: 17-Jul-2002; LatestRevisionNote: Re-released for DXP Platform.; Publisher: Altium Limited
P2 = Header 3: Header, 3-Pin; LatestRevisionDate: 17-Jul-2002; LatestRevisionNote: Re-released for DXP Platform.; Publisher: Altium Limited
Q1/DNP = RQ5E030RPTL: MOSFET (P-Channel); Manufacturer_Name: ROHM Semiconductor; Datasheet Link: https://www.mouser.com/datasheet/2/348/rq5e030rp-e-1596311.pdf; Height: 1mm; Manufacturer_Part_Number: RQ5E030RPTL; Mouser Part Number: 755-RQ5E030RPTL; Mouser Price/Stock: https://www.mouser.com/Search/Refine.aspx?Keyword=755-RQ5E030RPTL
Q2 Q3 Q5 = MOSFET-P: P-Channel MOSFET; Published: 8-Jun-2000; LatestRevisionDate: 17-Jul-2002; LatestRevisionNote: Re-released for DXP Platform.; PackageVersion: 1995/1996; PackageReference: E3; Publisher: Altium Limited; PackageDescription: TO, Flat Index; 3 In-Line, Axial Leads; Body Dia. 4.6mm; Lead Dia. 0.5 mm (max)
Q4 = MOSFET N: MOSFET N-CH 50V 220MA SOT-23; Part Number: BSS138CT-ND
Q6 Q7 = JFET-N: N-Channel JFET; Published: 8-Jun-2000; LatestRevisionDate: 17-Jul-2002; LatestRevisionNote: Re-released for DXP Platform.; PackageReference: TO-254-AA; Publisher: Altium Limited; Code_JEDEC: TO-254-AA
R1 R2 R4 R5 R13 R39-R42 R81 R82 R90 R91 = R: RES SMD 4.7K OHM 1% 1/16W 0603; Manufacturer Part Number: 1276-3466-2-ND; Manufacturer: Samsung; Part Number: P4.7KDBCT-ND; Type: Resistor; Rating: 1/16W; Tolerance: 1%; Distributor: Digikey; Distributor Part Number: 1276-3466-2-ND; Package: 0603
R3 R6-R9 R17 R20 R21 R23 R30 R78 R79 R87 = R: RES SMD 4.7K OHM 1% 1/16W 0603; Part Number: 311-10KGRTR-ND; Package: 0603; Type: Resistor
R10 R22 R26 R32 R38 = Res3: RES SMD 10K OHM 1% 1/16W 0603; Published: 8-Jun-2000; LatestRevisionDate: 29-May-2009; LatestRevisionNote: IPC-7351 Footprint Added.; PackageReference: J1-0603; Publisher: Altium Limited; PackageDescription: Chip Resistor
R11 R18 R19 R31 R33 R35 R37 R48 R52 R54 R57 = R: RES SMD 4.7K OHM 1% 1/16W 0603; Part Number: RR08P4.7KDTR-ND; Package: 0603; Type: Resistor
R12 R50 R51 R55 R63 = R: RES SMD 1K OHM 5% 1/10W 0603; Part Number: 311-1.0KGRTR-ND; Package: 0603; Type: Resistor
R14 R16 = R: RES SMD 10K OHM 1% 1/16W 0603; Part Number: RR08P4.7KDTR-ND; Package: 0603; Type: Resistor
R15 R34 R53 R65-R74 R80 R83 R85 R86 R88 = R: RES SMD 49.9 OHM 1% 1/16W 0603; Part Number: RR08P4.7KDTR-ND; Package: 0603; Type: Resistor
R24 = R: THERMISTOR NTC 10KOHM 3380K 0603; Part Number: 490-16279-2-ND; Type: Resistor; Package: 0603
R25 R27-R29 R84 = R: RES SMD 470 OHM 1% 1/10W 0603; Part Number: 311-470HRCT-ND; Type: Resistor; Package: 0603
R36 = R: Type: Resistor
R43-R47 R59-R61 R75-R77 = R: RES SMD 4.7K OHM 1% 1/16W 0603; Manufacturer Part Number: 1276-3466-2-ND; Manufacturer: Samsung; Part Number: P4.7KBDCT-ND; Type: Resistor; Rating: 1/16W; Tolerance: 1%; Distributor: Digikey; Distributor Part Number: 1276-3466-2-ND; Package: 0603
R49 = R: RES SMD 1K OHM 5% 1/10W 0603; Part Number: RNCP0603FTD75R0TR-ND; Type: Resistor; Package: 0603
R56 = R: RES SMD; Type: Resistor
R58 = R: RES SMD 0E OHM 5% 1/10W 0603; Package: 0603; Type: Resistor
R62 = R: RES SMD 1K OHM 5% 1/10W 0603; Part Number: 311-1.0KGRTR-ND; Manufacturer Part Number: 1276-3466-2-ND; Manufacturer: Samsung; Rating: 1/16W; Tolerance: 1%; Type: Resistor; Distributor: Digikey; Distributor Part Number: 1276-3466-2-ND; Package: 0603
R64 = R: RES SMD 2K OHM 1% 1/10W 0603; Part Number: YAG1297CT-ND; Package: 0603; Type: Resistor
S1 = SW-SPST: SWITCH TACTILE SPST-NO 0.05A 12V; Published: 24-Mar-1999; LatestRevisionDate: 17-Jul-2002; LatestRevisionNote: Re-released for DXP Platform.; PackageReference: SPST-2; Publisher: Altium Limited; PackageDescription: Switch; 2 Leads
S2 S3 = SW-PB: Switch; Published: 24-Mar-1999; LatestRevisionDate: 17-Jul-2002; LatestRevisionNote: Re-released for DXP Platform.; PackageReference: SPST-2; Publisher: Altium Limited; PackageDescription: Switch; 2 Leads
S4 = MHDR1X2: Header, 2-Pin; LatestRevisionDate: 17-Jul-2002; LatestRevisionNote: Re-released for DXP Platform.; Publisher: Altium Limited
T1-T13 = Test_P
U1/DNP = MT3608: Undefined or Miscellaneous; Manufacturer_Name: Aerosemi; Datasheet Link: https://www.olimex.com/Products/Breadboarding/BB-PWR-3608/resources/MT3608.pdf; Height: 1.45mm; Manufacturer_Part_Number: MT3608
U2 = PROG_ESP32_0: Part Number: 490107670412; Supplier 1: Digi-Key
U3 = SCD4x
U4 = MP1584_SOIC_0: IC RTC CLK/CALENDAR I2C 8-SOIC; Supplier 1: Newark
U5 = RGB_LED_PTH_0: Part Number: 754-1492-ND
U6 U12 U16 U24 U25 = LM258DT: LM258 Series 30 V 1.1 MHz Low Power Dual Operational Amplifier - SOIC-8; MF: Texas Instruments; MP: LM258D; Price: None; Availability: Unavailable; SnapEDA_Link: https://www.snapeda.com/parts/LM258D/Texas%20Instruments/view-part/588352/?ref=snap; Package: SOIC-8 STMicroelectronics; Value: *; Supplier 1: Digi-Key
U7 = 217175-0001: Connector; Manufacturer_Name: Molex; Datasheet Link: https://www.molex.com/pdm_docs/sd/2171750001_sd.pdf; Height: 3.46mm; Manufacturer_Part_Number: 217175-0001; Mouser Part Number: 538-217175-0001; Mouser Price/Stock: https://www.mouser.co.uk/ProductDetail/Molex/217175-0001?qs=DRkmTr78QARWJMiqNnldSg%3D%3D
U8 U14 = Spec_figaro_pth_0: SENS GAS SULF DIOX ANALG CUR MOD; part number: 1684-1042-ND; Supplier 1: Digi-Key
  U8: Supplier Part Number 1: 1684-1042-ND
  U14: Supplier Part Number 1: 1684-1009-ND
U9 U15 U21 = LMP91000SD/NOPB: 1 Channel AFE 8 Bit 14-WSON _4x4_; MF: Texas Instruments; Availability: Unavailable; Price: None; Package: WFDFN-14 Texas Instruments; MP: LMP91000SD/NOPB; SnapEDA_Link: https://www.snapeda.com/parts/LMP91000SD/NOPB/Texas%20Instruments/view-part/547082/?ref=snap; Value: *
  U21: Supplier 1: Digi-Key
U10 = ESP32_SMD_1: WIFI MODULE 128MBITS SPI FLASH; Part Number: 356-ES32WROOM32D16MB; Supplier 1: Mouser
U11 = CON_AC_1: CONN HEADER VERT 2POS 2.54MM; Part Number: 609-4434-ND; Supplier 1: Newark
U13 = TLV70033DDCT: 3.3V LDO; Manufacturer: Texas Instruments; Regulator Topology: Positive Fixed; Current - Output: 200mA; Voltage - Input: Up to 5.5V; Current - Limit (Min): 220mA; Manufacturer Part Number: LM1117; RoHS: RoHS Compliant; Category: Integrated Circuits (ICs); Stock 1: 5021; Pricing 1: 1=0.53, 10=0.452, 100=0.3374 (USD); Packaging: Cut Tape (CT); Part Status: Active; Voltage - Output: 3.3V; Voltage - Dropout (Typical): -; Operating Temperature: -40°C ~ 125°C; Mounting Type: Surface Mount; Package / Case: SOT-23-5 Thin, TSOT-23-5; Supplier Device Package: SOT-23-5; ComponentLink1URL: http://www.ti.com/lit/ds/slvsa00e/slvsa00e.pdf; ComponentLink1Description: http://www.ti.com/lit/ds/slvsa00e/slvsa00e.pdf; Supplier 1: Digi-Key
U17 = SCD_0: CONN HEADER VERT 7POS 2.54MM FOR SCD30; Supplier 1: Digi-Key; Supplier Part Number 1: SAM15490CT-ND
U18 U23 = ADS1115: IC ADC 16BIT SIGMA-DELTA 10VSSOP; Part Number: 595-ADS1115IDGST; Supplier 1: Digi-Key
  U18: Supplier Part Number 1: 296-24934-1-ND
U19 = Spec_figaro_pth_0: SENS GAS SULF DIOX ANALG CUR MOD; Supplier 1: Digi-Key
U20 = MICS6814_0: Supplier 1: Newark
U22 = TGS2602_1: Part Number: TGS2602; Supplier 1: RSComponents; Supplier Part Number 1: 1346640
U26 = TGS5141: part number: TGS5141-P00
U27 = TLV70033DDCT: 3.3V LDO; Manufacturer: Texas Instruments; Manufacturer Part Number: LM1117; Regulator Topology: Positive Fixed; Current - Output: 200mA; Voltage - Input: Up to 5.5V; Current - Limit (Min): 220mA; RoHS: RoHS Compliant; Category: Integrated Circuits (ICs); Stock 1: 5021; Pricing 1: 1=0.53, 10=0.452, 100=0.3374 (USD); Packaging: Cut Tape (CT); Part Status: Active; Voltage - Output: 3.3V; Voltage - Dropout (Typical): -; Operating Temperature: -40°C ~ 125°C; Mounting Type: Surface Mount; Package / Case: SOT-23-5 Thin, TSOT-23-5; Supplier Device Package: SOT-23-5; ComponentLink1URL: http://www.ti.com/lit/ds/slvsa00e/slvsa00e.pdf; ComponentLink1Description: http://www.ti.com/lit/ds/slvsa00e/slvsa00e.pdf; Supplier 1: Digi-Key; Supplier Part Number 1: LM1117IMP-3.3/NOPBCT-ND
U28/DNP = TP4056: Connector; Manufacturer_Name: NanJing Top Power; Datasheet Link: https://dlnmh9ip6v2uc.cloudfront.net/datasheets/Prototyping/TP4056.pdf; Height: 1.75mm; Manufacturer_Part_Number: TP4056
U29 = SGP40-D-R4: Integrated Circuit; Manufacturer_Name: Sensirion; Datasheet Link: https://www.mouser.com/datasheet/2/682/Sensirion_Gas_Sensors_SGP40_Datasheet-1888696.pdf; Height: 0.95mm; Manufacturer_Part_Number: SGP40-D-R4; Mouser Part Number: 403-SGP40-D-R4; Mouser Price/Stock: https://www.mouser.co.uk/ProductDetail/Sensirion/SGP40-D-R4?qs=yqaQSyyJnNgaRqiZfsbS1Q%3D%3D; Arrow Part Number: SGP40-D-R4; Arrow Price/Stock: https://www.arrow.com/en/products/sgp40-d-r4/sensirion-ag?region=europe
VR1-VR3 = LM4120AIM5-2.5: Precision Micropower Low Dropout Voltage Reference 5-SOT-23 -40 to 85; MF: Texas Instruments; SnapEDA_Link: https://www.snapeda.com/parts/LM4120AIM5-2.5/Texas%20Instruments/view-part/30670/?ref=snap; Price: None; Availability: Unavailable; Package: SOT-23 Texas Instruments; MP: LM4120AIM5-2.5; Value: *; Supplier 1: Digi-Key
  VR1: Supplier Part Number 1: LM4120AIM5-2.5/NOPBCT-ND
X1 = XTAL_2-pin: XTAL SMD 3215, 32.768kHz, Cl=9pF, Total Tol: ±50ppm; Part Number: XC1911TR-ND; Note: XTAL SMD 32.768kHz; Artikkelnr Noca: N.A.; Manufacturer: *; Manufacturer Part Number: *; Datasheet: *; LatestRevisionDate: 2016-08-19; Pin Count: 2; Publisher: Nordic Semiconductor; Published: 2016-08-19; Value: 32.768kHz; Supplier: *; Supplier part number: *; 2nd source Supplier: *; 2nd source part number: *; Footprint Doc: XTAL_3215; Artikkelnr Simpro: N.A.; Supplier 1: Digi-Key; Supplier Part Number 1: 535-9033-1-ND
ZD1 = D Zener: Zener Diode; Published: 8-Jun-2000; LatestRevisionDate: 17-Jul-2002; LatestRevisionNote: Re-released for DXP Platform.; PackageReference: DIODE-0.7; Publisher: Altium Limited; PackageDescription: Diode, Thru-Hole; 2 Leads; 0.7 in Pin Spacing